# EAGLE design narvi-cpu (EAGLE 7.3.0)
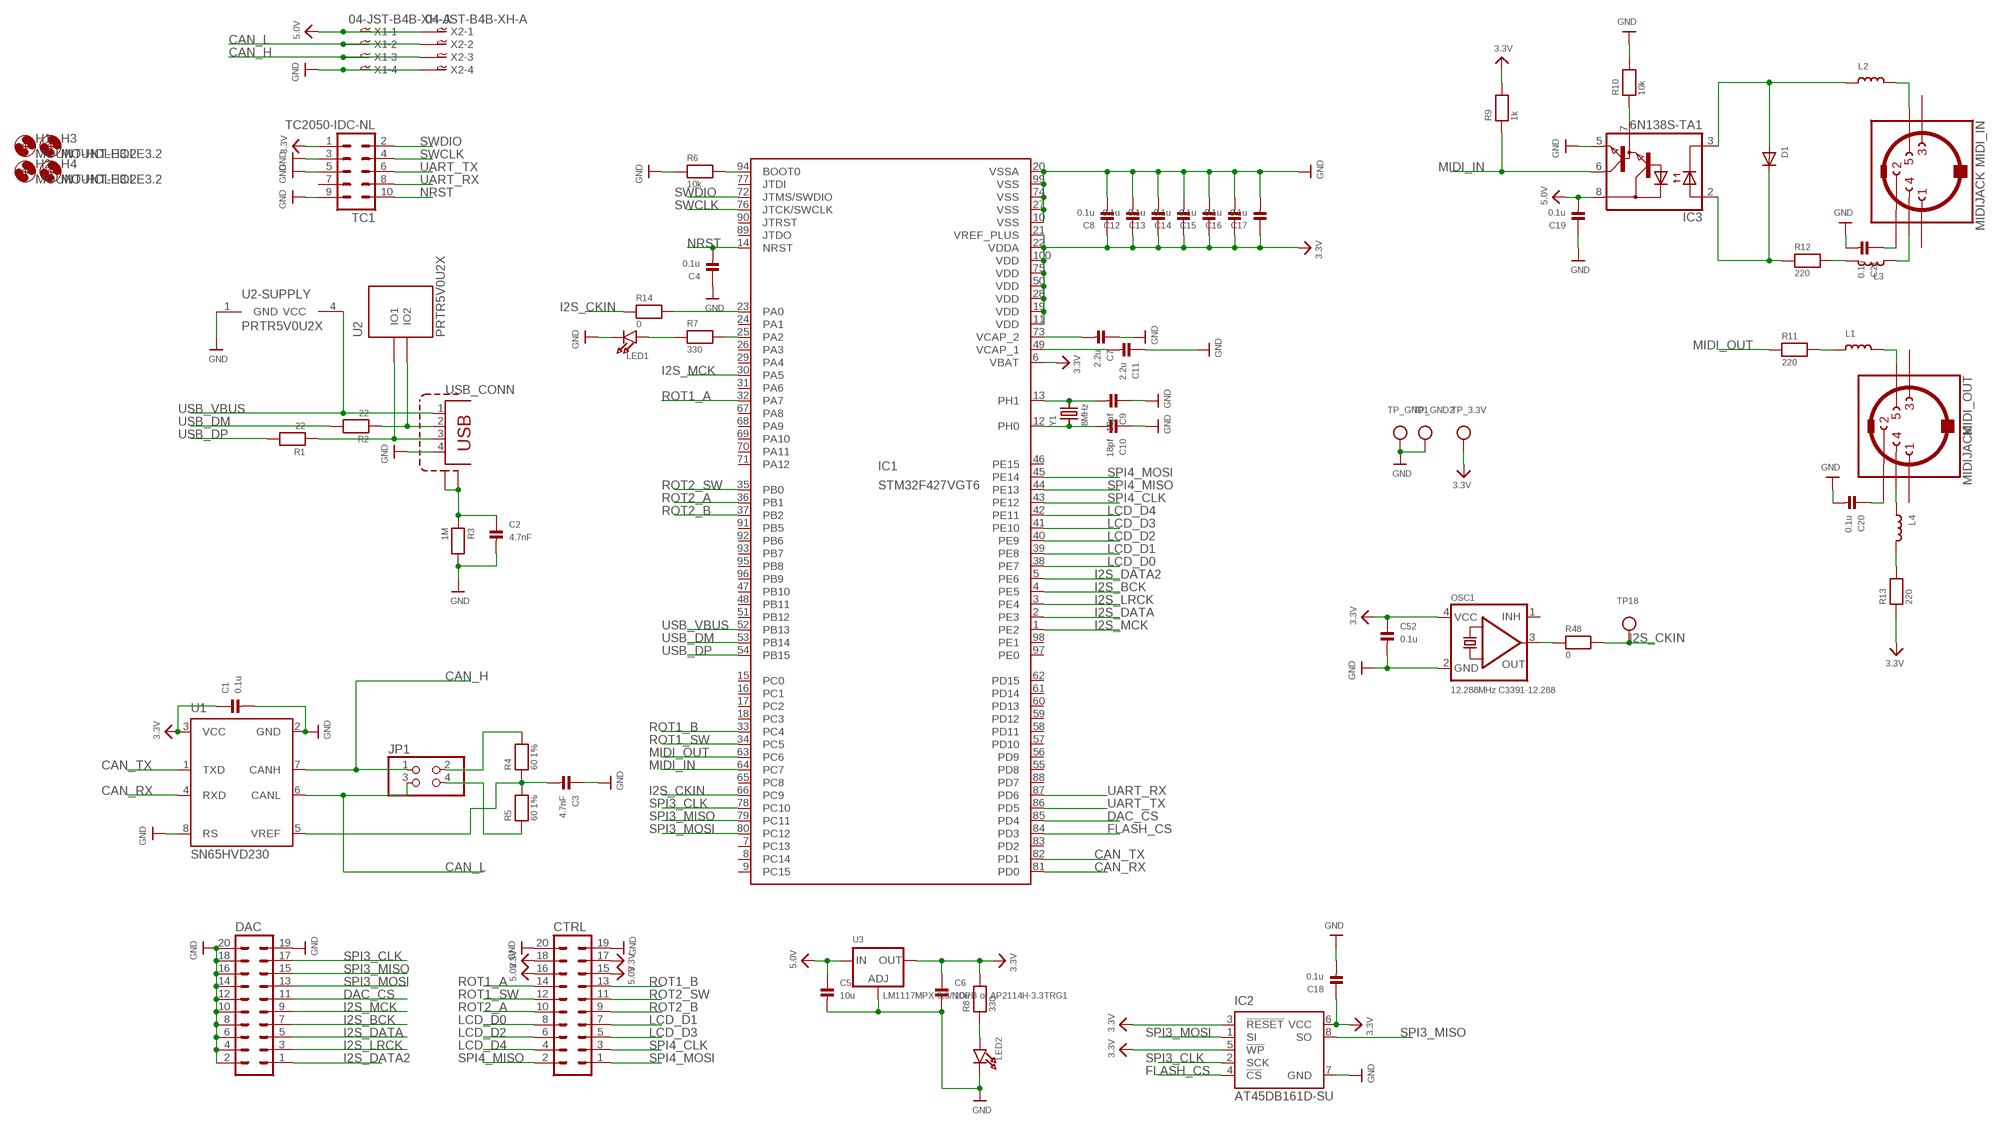
[diagram p0: schematic, sheet 1]

## Parts
C1  0.1u  CAP_CERAMIC0603  [0603]
C2  4.7nF  CAP_CERAMIC0805  [0805]
C3  4.7nF  CAP_CERAMIC0805  [0805]
C4  0.1u  CAP_CERAMIC0603  [0603]
C5  10u  CAP_CERAMIC0805  [0805]
C6  10u  CAP_CERAMIC0805  [0805]
C7  2.2u  CAP_CERAMIC0805  [0805]
C8  0.1u  CAP_CERAMIC0603  [0603]
C9  18pf  CAP_CERAMIC0805  [0805]
C10  18pf  CAP_CERAMIC0805  [0805]
C11  2.2u  CAP_CERAMIC0805  [0805]
C12  0.1u  CAP_CERAMIC0603  [0603]
C13  0.1u  CAP_CERAMIC0603  [0603]
C14  0.1u  CAP_CERAMIC0603  [0603]
C15  0.1u  CAP_CERAMIC0603  [0603]
C16  0.1u  CAP_CERAMIC0603  [0603]
C17  0.1u  CAP_CERAMIC0603  [0603]
C18  0.1u  CAP_CERAMIC0603  [0603]
C19  0.1u  CAP_CERAMIC0603  [0603]
C20  0.1u  CAP_CERAMIC0603  [0603]
C21  0.1u  CAP_CERAMIC0603  [0603]
C52  0.1u  CAP_CERAMIC0603  [0603]
CTRL  ML20  [ML20]
D1  DIODESOD-123  [SOD-123]
DAC  ML20  [ML20]
H1  MOUNT-HOLE3.2  [3,2]
H2  MOUNT-HOLE3.2  [3,2]
H3  MOUNT-HOLE3.2  [3,2]
H4  MOUNT-HOLE3.2  [3,2]
IC1  STM32F427VGT6  STM32F42X_43X_LQFP100  [TQFP100]
IC2  AT45DB161D-SU  [8S2]
IC3  6N138S-TA1  6N138SMD  [SO8-GW300]
JP1  PINHD-2X2  [2X02]
L1  INDUCTOR0805  [0805]
L2  INDUCTOR0805  [0805]
L3  INDUCTOR0805  [0805]
L4  INDUCTOR0805  [0805]
LED1  LED0805  [CHIPLED_0805]
LED2  LED0805  [CHIPLED_0805]
MIDI_IN  MIDIJACK  [CP-2350]
MIDI_OUT  MIDIJACK  [CP-2350]
OSC1  12.288MHz C3391-12.288  OSCILLATOR  [OSC_7X5MM]
R1  22  RESISTOR0805  [0805]
R2  22  RESISTOR0805  [0805]
R3  1M  RESISTOR0805  [0805]
R4  60 1%  RESISTOR0805  [0805]
R5  60 1%  RESISTOR0805  [0805]
R6  10k  RESISTOR0805  [0805]
R7  330  RESISTOR0805  [0805]
R8  330  RESISTOR0805  [0805]
R9  1k  RESISTOR0805  [0805]
R10  10k  RESISTOR0805  [0805]
R11  220  RESISTOR0805  [0805]
R12  220  RESISTOR0805  [0805]
R13  220  RESISTOR0805  [0805]
R14  0  RESISTOR0805  [0805]
R48  0  RESISTOR_0805  [_0805]
TC1  TC2050-IDC-NL  [TC2050-IDC-NL]
TP18  TESTPOINT0.1"  [1X01_ROUND]
TP_3.3V  TESTPOINT0.1"  [1X01_ROUND]
TP_GND1  TESTPOINT0.1"  [1X01_ROUND]
TP_GND2  TESTPOINT0.1"  [1X01_ROUND]
U1  SN65HVD230  [SO8]
U2  PRTR5V0U2X  [SOT-143B]
U3  LM1117MPX-3.3/NOPB or AP2114H-3.3TRG1  LM1117SOT223-REFLOW  [SOT223-R]
USB  TE-292304-1  [TE-292304-1]
X1  04-JST-B4B-XH-A  [B4B-XH]
X2  04-JST-B4B-XH-A  [B4B-XH]
Y1  8MHz  CRYSTALSMD  [HC49UP]

## Nets
3.3V: C1.1 C6.1 C8.1 C12.1 C13.1 C14.1 C15.1 C16.1 C17.1 C18.1 C52.1 CTRL.17 CTRL.18 IC1.6(VBAT) IC1.11(VDD) IC1.19(VDD) IC1.21(VREF_PLUS) IC1.22(VDDA) IC1.28(VDD) IC1.50(VDD) IC1.75(VDD) IC1.100(VDD) IC2.3(!RESET) IC2.5(!WP) IC2.6(VCC) OSC1.4(VCC) R8.2 R9.2 R13.1 TC1.1 TP_3.3V.1 U1.3(VCC) U3.2(OUT)
5.0V: C5.1 C19.2 CTRL.15 CTRL.16 IC3.8(VCC) U3.3(IN) X1.P$1 X2.P$1
CAN_H: JP1.1 U1.7(CANH) X1.P$3 X2.P$3
CAN_L: JP1.3 U1.6(CANL) X1.P$2 X2.P$2
CAN_RX: IC1.81(PD0) U1.4(RXD)
CAN_TX: IC1.82(PD1) U1.1(TXD)
DAC_CS: DAC.11 IC1.85(PD4)
FLASH_CS: IC1.84(PD3) IC2.4(!CS)
GND: C1.2 C2.2 C3.1 C4.1 C5.2 C6.2 C7.1 C8.2 C9.1 C10.1 C11.1 C12.2 C13.2 C14.2 C15.2 C16.2 C17.2 C18.2 C19.1 C20.2 C21.2 C52.2 CTRL.19 CTRL.20 DAC.2 DAC.4 DAC.6 DAC.8 DAC.10 DAC.12 DAC.14 DAC.16 DAC.18 DAC.19 DAC.20 IC1.10(VSS) IC1.20(VSSA) IC1.27(VSS) IC1.74(VSS) IC1.99(VSS) IC2.7(GND) IC3.5(GND) LED1.C LED2.C OSC1.2(GND) R3.2 R6.1 R10.2 TC1.3 TC1.5 TC1.9 TP_GND1.1 TP_GND2.1 U1.2(GND) U1.8(RS) U2.1(GND) U3.1(ADJ) USB.4 X1.P$4 X2.P$4
I2S_BCK: DAC.7 IC1.4(PE5)
I2S_CKIN: IC1.66(PC9) R14.1 R48.2 TP18.1
I2S_DATA: DAC.5 IC1.2(PE3)
I2S_DATA2: DAC.1 IC1.5(PE6)
I2S_LRCK: DAC.3 IC1.3(PE4)
I2S_MCK: DAC.9 IC1.1(PE2) IC1.30(PA5)
LCD_D0: CTRL.8 IC1.38(PE7)
LCD_D1: CTRL.7 IC1.39(PE8)
LCD_D2: CTRL.6 IC1.40(PE9)
LCD_D3: CTRL.5 IC1.41(PE10)
LCD_D4: CTRL.4 IC1.42(PE11)
MIDI_IN: IC1.64(PC7) IC3.6(VO) R9.1
MIDI_OUT: IC1.63(PC6) R11.1
N$1: IC1.94(BOOT0) R6.2
N$2: C11.2 IC1.49(VCAP_1)
N$3: C7.2 IC1.73(VCAP_2)
N$4: C9.2 IC1.13(PH1) Y1.2
N$5: C10.2 IC1.12(PH0) Y1.1
N$6: LED2.A R8.1
N$7: JP1.2 R4.2
N$8: JP1.4 R5.1
N$9: C3.2 R4.1 R5.2 U1.5(VREF)
N$10: IC1.25(PA2) R7.2
N$11: IC1.23(PA0) R14.2
N$12: LED1.A R7.1
N$14: L1.2 MIDI_OUT.5
N$15: L1.1 R11.2
N$16: L3.1 MIDI_IN.4
N$17: D1.C IC3.2(A) R12.1
N$18: R2.1 U2.3(IO2) USB.2
N$19: R1.1 U2.2(IO1) USB.3
N$20: C2.1 R3.1 USB.P$1(SHIELD:S1) USB.P$2(SHIELD:S2)
N$21: D1.A IC3.3(C) L2.1
N$22: IC3.7(VB) R10.1
N$23: C20.1 MIDI_OUT.2
N$24: C21.1 MIDI_IN.2
N$25: L2.2 MIDI_IN.5
N$26: L3.2 R12.2
N$27: L4.2 R13.2
N$28: L4.1 MIDI_OUT.4
N$32: OSC1.3(OUT) R48.1
NRST: C4.2 IC1.14(NRST) TC1.10
ROT1_A: CTRL.14 IC1.32(PA7)
ROT1_B: CTRL.13 IC1.33(PC4)
ROT1_SW: CTRL.12 IC1.34(PC5)
ROT2_A: CTRL.10 IC1.36(PB1)
ROT2_B: CTRL.9 IC1.37(PB2)
ROT2_SW: CTRL.11 IC1.35(PB0)
SPI3_CLK: DAC.17 IC1.78(PC10) IC2.2(SCK)
SPI3_MISO: DAC.15 IC1.79(PC11) IC2.8(SO)
SPI3_MOSI: DAC.13 IC1.80(PC12) IC2.1(SI)
SPI4_CLK: CTRL.3 IC1.43(PE12)
SPI4_MISO: CTRL.2 IC1.44(PE13)
SPI4_MOSI: CTRL.1 IC1.45(PE14)
SWCLK: IC1.76(JTCK/SWCLK) TC1.4
SWDIO: IC1.72(JTMS/SWDIO) TC1.2
UART_RX: IC1.87(PD6) TC1.8
UART_TX: IC1.86(PD5) TC1.6
USB_DM: IC1.53(PB14) R2.2
USB_DP: IC1.54(PB15) R1.2
USB_VBUS: IC1.52(PB13) U2.4(VCC) USB.1
Unconnected: IC1.7(PC13) IC1.8(PC14) IC1.9(PC15) IC1.15(PC0) IC1.16(PC1) IC1.17(PC2) IC1.18(PC3) IC1.24(PA1) IC1.26(PA3) IC1.29(PA4) IC1.31(PA6) IC1.46(PE15) IC1.47(PB10) IC1.48(PB11) IC1.51(PB12) IC1.55(PD8) IC1.56(PD9) IC1.57(PD10) IC1.58(PD11) IC1.59(PD12) IC1.60(PD13) IC1.61(PD14) IC1.62(PD15) IC1.65(PC8) IC1.67(PA8) IC1.68(PA9) IC1.69(PA10) IC1.70(PA11) IC1.71(PA12) IC1.77(JTDI) IC1.83(PD2) IC1.88(PD7) IC1.89(JTDO) IC1.90(JTRST) IC1.91(PB5) IC1.92(PB6) IC1.93(PB7) IC1.95(PB8) IC1.96(PB9) IC1.97(PE0) IC1.98(PE1) MIDI_IN.1 MIDI_IN.3 MIDI_OUT.1 MIDI_OUT.3 OSC1.1(INH) TC1.7

## Library data of the parts
C1 C4 C8 C12-C21 = microbuilder:CAP_CERAMIC: Ceramic Capacitors 0402 - 0402 Surface Mount Capacitors 16pF 50V 5% [Digikey: 445-4899-2-ND] 18pF 50V 5% [Digikey: 490-1281-2-ND] 22pF 50V 5% [Digikey: 490-1283-2-ND] 68pF 50V 5% [Digikey: 490-1289-2-ND] 0.1uF 10V 10% [Digikey: 490-1318-2-ND] 1.0uF 6.3V 10% [Digikey: 490-1320-2-ND] 0603 - 0603 Surface Mount Capacitors 16 pF 50V 5% [Digikey: 445-5051-2-ND] 22 pF 50V [Digikey: PCC220ACVTR-ND] 33 pF 50V 5% [Digikey: 490-1415-1-ND] 56pF 50V 5% [Digikey: 490-1421-1-ND] 220pF 50V 5% [Digikey: 445-1285-1-ND] 680 pF 50V 2200 pF 50V 5% C0G [Digikey: 445-1297-1-ND] 5600 pF 100V 5% X7R [Digikey: 478-3711-1-ND] 0.1 µF 25V 10% [Digikey: PCC2277TR-ND] 0.22 µF 16V 10% X7R [Digikey: 445-1318-1-ND] 1.0 µF 25V 10% [Digikey: 445-5146-2-ND] 0603 - RF Specific 3pF 250V +/-0.1pF RF [Digikey: 712-1347-1-ND] 18 pF 250V 5% [Digikey: 478-3505-1-ND or 712-1322-1-ND] 56 pF 250V 5% C0G RF [Digikey: 490-4867-1-ND] 68 pF 250V RF [Digikey: 490-4868-1-ND] 0805 - 0805 Surface Mount Capacitors 220 pF 250V 2% RF Ceramic Capacitor [Digikey: 712-1398-1-ND] 1000 pF 50V 2% NP0 Ceramic Capacitor [Digikey: 478-3760-1-ND] 0.1 µF 25V 10% Ceramic Capacitor [Digikey: PCC1828TR-ND] 1.0 µF 16V 10% Ceramic Capacitor[Digikey: 490-1691-2-ND] 10.0 µF 10V 10% Ceramic Capacitor[Digikey: 709-1228-1-ND] 10.0 uF 16V 10% Ceramic Capacitor [Digikey: 478-5165-2-ND] 47 uF 6.3V 20% Ceramic Capacitor [Digikey: 587-1779-1-ND or 399-5506-1-ND] 1206 - 1206 Surface Mount Capacitors 47uF 10V 20% Ceramic Capacitor [Digikey: 490-5528-1-ND or 399-5508-1-ND or 445-6010-1-ND] 100uF 6.3V -20%, +80% Y5V Ceramic Capacitor (Digikey: 490-4512-1-ND, Mouser: 81-GRM31CF50J107ZE1L); PARTNO: 0805DD104KAT2A
C2 C3 = microbuilder:CAP_CERAMIC: Ceramic Capacitors 0402 - 0402 Surface Mount Capacitors 16pF 50V 5% [Digikey: 445-4899-2-ND] 18pF 50V 5% [Digikey: 490-1281-2-ND] 22pF 50V 5% [Digikey: 490-1283-2-ND] 68pF 50V 5% [Digikey: 490-1289-2-ND] 0.1uF 10V 10% [Digikey: 490-1318-2-ND] 1.0uF 6.3V 10% [Digikey: 490-1320-2-ND] 0603 - 0603 Surface Mount Capacitors 16 pF 50V 5% [Digikey: 445-5051-2-ND] 22 pF 50V [Digikey: PCC220ACVTR-ND] 33 pF 50V 5% [Digikey: 490-1415-1-ND] 56pF 50V 5% [Digikey: 490-1421-1-ND] 220pF 50V 5% [Digikey: 445-1285-1-ND] 680 pF 50V 2200 pF 50V 5% C0G [Digikey: 445-1297-1-ND] 5600 pF 100V 5% X7R [Digikey: 478-3711-1-ND] 0.1 µF 25V 10% [Digikey: PCC2277TR-ND] 0.22 µF 16V 10% X7R [Digikey: 445-1318-1-ND] 1.0 µF 25V 10% [Digikey: 445-5146-2-ND] 0603 - RF Specific 3pF 250V +/-0.1pF RF [Digikey: 712-1347-1-ND] 18 pF 250V 5% [Digikey: 478-3505-1-ND or 712-1322-1-ND] 56 pF 250V 5% C0G RF [Digikey: 490-4867-1-ND] 68 pF 250V RF [Digikey: 490-4868-1-ND] 0805 - 0805 Surface Mount Capacitors 220 pF 250V 2% RF Ceramic Capacitor [Digikey: 712-1398-1-ND] 1000 pF 50V 2% NP0 Ceramic Capacitor [Digikey: 478-3760-1-ND] 0.1 µF 25V 10% Ceramic Capacitor [Digikey: PCC1828TR-ND] 1.0 µF 16V 10% Ceramic Capacitor[Digikey: 490-1691-2-ND] 10.0 µF 10V 10% Ceramic Capacitor[Digikey: 709-1228-1-ND] 10.0 uF 16V 10% Ceramic Capacitor [Digikey: 478-5165-2-ND] 47 uF 6.3V 20% Ceramic Capacitor [Digikey: 587-1779-1-ND or 399-5506-1-ND] 1206 - 1206 Surface Mount Capacitors 47uF 10V 20% Ceramic Capacitor [Digikey: 490-5528-1-ND or 399-5508-1-ND or 445-6010-1-ND] 100uF 6.3V -20%, +80% Y5V Ceramic Capacitor (Digikey: 490-4512-1-ND, Mouser: 81-GRM31CF50J107ZE1L); PARTNO: 885012207090
C5 C6 = microbuilder:CAP_CERAMIC: Ceramic Capacitors 0402 - 0402 Surface Mount Capacitors 16pF 50V 5% [Digikey: 445-4899-2-ND] 18pF 50V 5% [Digikey: 490-1281-2-ND] 22pF 50V 5% [Digikey: 490-1283-2-ND] 68pF 50V 5% [Digikey: 490-1289-2-ND] 0.1uF 10V 10% [Digikey: 490-1318-2-ND] 1.0uF 6.3V 10% [Digikey: 490-1320-2-ND] 0603 - 0603 Surface Mount Capacitors 16 pF 50V 5% [Digikey: 445-5051-2-ND] 22 pF 50V [Digikey: PCC220ACVTR-ND] 33 pF 50V 5% [Digikey: 490-1415-1-ND] 56pF 50V 5% [Digikey: 490-1421-1-ND] 220pF 50V 5% [Digikey: 445-1285-1-ND] 680 pF 50V 2200 pF 50V 5% C0G [Digikey: 445-1297-1-ND] 5600 pF 100V 5% X7R [Digikey: 478-3711-1-ND] 0.1 µF 25V 10% [Digikey: PCC2277TR-ND] 0.22 µF 16V 10% X7R [Digikey: 445-1318-1-ND] 1.0 µF 25V 10% [Digikey: 445-5146-2-ND] 0603 - RF Specific 3pF 250V +/-0.1pF RF [Digikey: 712-1347-1-ND] 18 pF 250V 5% [Digikey: 478-3505-1-ND or 712-1322-1-ND] 56 pF 250V 5% C0G RF [Digikey: 490-4867-1-ND] 68 pF 250V RF [Digikey: 490-4868-1-ND] 0805 - 0805 Surface Mount Capacitors 220 pF 250V 2% RF Ceramic Capacitor [Digikey: 712-1398-1-ND] 1000 pF 50V 2% NP0 Ceramic Capacitor [Digikey: 478-3760-1-ND] 0.1 µF 25V 10% Ceramic Capacitor [Digikey: PCC1828TR-ND] 1.0 µF 16V 10% Ceramic Capacitor[Digikey: 490-1691-2-ND] 10.0 µF 10V 10% Ceramic Capacitor[Digikey: 709-1228-1-ND] 10.0 uF 16V 10% Ceramic Capacitor [Digikey: 478-5165-2-ND] 47 uF 6.3V 20% Ceramic Capacitor [Digikey: 587-1779-1-ND or 399-5506-1-ND] 1206 - 1206 Surface Mount Capacitors 47uF 10V 20% Ceramic Capacitor [Digikey: 490-5528-1-ND or 399-5508-1-ND or 445-6010-1-ND] 100uF 6.3V -20%, +80% Y5V Ceramic Capacitor (Digikey: 490-4512-1-ND, Mouser: 81-GRM31CF50J107ZE1L); PARTNO: 81-GRM21BR6YA106KE3L
C7 C11 = microbuilder:CAP_CERAMIC: Ceramic Capacitors 0402 - 0402 Surface Mount Capacitors 16pF 50V 5% [Digikey: 445-4899-2-ND] 18pF 50V 5% [Digikey: 490-1281-2-ND] 22pF 50V 5% [Digikey: 490-1283-2-ND] 68pF 50V 5% [Digikey: 490-1289-2-ND] 0.1uF 10V 10% [Digikey: 490-1318-2-ND] 1.0uF 6.3V 10% [Digikey: 490-1320-2-ND] 0603 - 0603 Surface Mount Capacitors 16 pF 50V 5% [Digikey: 445-5051-2-ND] 22 pF 50V [Digikey: PCC220ACVTR-ND] 33 pF 50V 5% [Digikey: 490-1415-1-ND] 56pF 50V 5% [Digikey: 490-1421-1-ND] 220pF 50V 5% [Digikey: 445-1285-1-ND] 680 pF 50V 2200 pF 50V 5% C0G [Digikey: 445-1297-1-ND] 5600 pF 100V 5% X7R [Digikey: 478-3711-1-ND] 0.1 µF 25V 10% [Digikey: PCC2277TR-ND] 0.22 µF 16V 10% X7R [Digikey: 445-1318-1-ND] 1.0 µF 25V 10% [Digikey: 445-5146-2-ND] 0603 - RF Specific 3pF 250V +/-0.1pF RF [Digikey: 712-1347-1-ND] 18 pF 250V 5% [Digikey: 478-3505-1-ND or 712-1322-1-ND] 56 pF 250V 5% C0G RF [Digikey: 490-4867-1-ND] 68 pF 250V RF [Digikey: 490-4868-1-ND] 0805 - 0805 Surface Mount Capacitors 220 pF 250V 2% RF Ceramic Capacitor [Digikey: 712-1398-1-ND] 1000 pF 50V 2% NP0 Ceramic Capacitor [Digikey: 478-3760-1-ND] 0.1 µF 25V 10% Ceramic Capacitor [Digikey: PCC1828TR-ND] 1.0 µF 16V 10% Ceramic Capacitor[Digikey: 490-1691-2-ND] 10.0 µF 10V 10% Ceramic Capacitor[Digikey: 709-1228-1-ND] 10.0 uF 16V 10% Ceramic Capacitor [Digikey: 478-5165-2-ND] 47 uF 6.3V 20% Ceramic Capacitor [Digikey: 587-1779-1-ND or 399-5506-1-ND] 1206 - 1206 Surface Mount Capacitors 47uF 10V 20% Ceramic Capacitor [Digikey: 490-5528-1-ND or 399-5508-1-ND or 445-6010-1-ND] 100uF 6.3V -20%, +80% Y5V Ceramic Capacitor (Digikey: 490-4512-1-ND, Mouser: 81-GRM31CF50J107ZE1L); PARTNO: 581-08053D225MAT2A
C9 C10 = microbuilder:CAP_CERAMIC: Ceramic Capacitors 0402 - 0402 Surface Mount Capacitors 16pF 50V 5% [Digikey: 445-4899-2-ND] 18pF 50V 5% [Digikey: 490-1281-2-ND] 22pF 50V 5% [Digikey: 490-1283-2-ND] 68pF 50V 5% [Digikey: 490-1289-2-ND] 0.1uF 10V 10% [Digikey: 490-1318-2-ND] 1.0uF 6.3V 10% [Digikey: 490-1320-2-ND] 0603 - 0603 Surface Mount Capacitors 16 pF 50V 5% [Digikey: 445-5051-2-ND] 22 pF 50V [Digikey: PCC220ACVTR-ND] 33 pF 50V 5% [Digikey: 490-1415-1-ND] 56pF 50V 5% [Digikey: 490-1421-1-ND] 220pF 50V 5% [Digikey: 445-1285-1-ND] 680 pF 50V 2200 pF 50V 5% C0G [Digikey: 445-1297-1-ND] 5600 pF 100V 5% X7R [Digikey: 478-3711-1-ND] 0.1 µF 25V 10% [Digikey: PCC2277TR-ND] 0.22 µF 16V 10% X7R [Digikey: 445-1318-1-ND] 1.0 µF 25V 10% [Digikey: 445-5146-2-ND] 0603 - RF Specific 3pF 250V +/-0.1pF RF [Digikey: 712-1347-1-ND] 18 pF 250V 5% [Digikey: 478-3505-1-ND or 712-1322-1-ND] 56 pF 250V 5% C0G RF [Digikey: 490-4867-1-ND] 68 pF 250V RF [Digikey: 490-4868-1-ND] 0805 - 0805 Surface Mount Capacitors 220 pF 250V 2% RF Ceramic Capacitor [Digikey: 712-1398-1-ND] 1000 pF 50V 2% NP0 Ceramic Capacitor [Digikey: 478-3760-1-ND] 0.1 µF 25V 10% Ceramic Capacitor [Digikey: PCC1828TR-ND] 1.0 µF 16V 10% Ceramic Capacitor[Digikey: 490-1691-2-ND] 10.0 µF 10V 10% Ceramic Capacitor[Digikey: 709-1228-1-ND] 10.0 uF 16V 10% Ceramic Capacitor [Digikey: 478-5165-2-ND] 47 uF 6.3V 20% Ceramic Capacitor [Digikey: 587-1779-1-ND or 399-5506-1-ND] 1206 - 1206 Surface Mount Capacitors 47uF 10V 20% Ceramic Capacitor [Digikey: 490-5528-1-ND or 399-5508-1-ND or 445-6010-1-ND] 100uF 6.3V -20%, +80% Y5V Ceramic Capacitor (Digikey: 490-4512-1-ND, Mouser: 81-GRM31CF50J107ZE1L); PARTNO: C0805C180M3GACTU
C52 = microbuilder:CAP_CERAMIC: Ceramic Capacitors 0402 - 0402 Surface Mount Capacitors 16pF 50V 5% [Digikey: 445-4899-2-ND] 18pF 50V 5% [Digikey: 490-1281-2-ND] 22pF 50V 5% [Digikey: 490-1283-2-ND] 68pF 50V 5% [Digikey: 490-1289-2-ND] 0.1uF 10V 10% [Digikey: 490-1318-2-ND] 1.0uF 6.3V 10% [Digikey: 490-1320-2-ND] 0603 - 0603 Surface Mount Capacitors 16 pF 50V 5% [Digikey: 445-5051-2-ND] 22 pF 50V [Digikey: PCC220ACVTR-ND] 33 pF 50V 5% [Digikey: 490-1415-1-ND] 56pF 50V 5% [Digikey: 490-1421-1-ND] 220pF 50V 5% [Digikey: 445-1285-1-ND] 680 pF 50V 2200 pF 50V 5% C0G [Digikey: 445-1297-1-ND] 5600 pF 100V 5% X7R [Digikey: 478-3711-1-ND] 0.1 µF 25V 10% [Digikey: PCC2277TR-ND] 0.22 µF 16V 10% X7R [Digikey: 445-1318-1-ND] 1.0 µF 25V 10% [Digikey: 445-5146-2-ND] 0603 - RF Specific 3pF 250V +/-0.1pF RF [Digikey: 712-1347-1-ND] 18 pF 250V 5% [Digikey: 478-3505-1-ND or 712-1322-1-ND] 56 pF 250V 5% C0G RF [Digikey: 490-4867-1-ND] 68 pF 250V RF [Digikey: 490-4868-1-ND] 0805 - 0805 Surface Mount Capacitors 220 pF 250V 2% RF Ceramic Capacitor [Digikey: 712-1398-1-ND] 1000 pF 50V 2% NP0 Ceramic Capacitor [Digikey: 478-3760-1-ND] 0.1 µF 25V 10% Ceramic Capacitor [Digikey: PCC1828TR-ND] 1.0 µF 16V 10% Ceramic Capacitor[Digikey: 490-1691-2-ND] 10.0 µF 10V 10% Ceramic Capacitor[Digikey: 709-1228-1-ND] 10.0 uF 16V 10% Ceramic Capacitor [Digikey: 478-5165-2-ND] 47 uF 6.3V 20% Ceramic Capacitor [Digikey: 587-1779-1-ND or 399-5506-1-ND] 1206 - 1206 Surface Mount Capacitors 47uF 10V 20% Ceramic Capacitor [Digikey: 490-5528-1-ND or 399-5508-1-ND or 445-6010-1-ND] 100uF 6.3V -20%, +80% Y5V Ceramic Capacitor (Digikey: 490-4512-1-ND, Mouser: 81-GRM31CF50J107ZE1L)
CTRL DAC = con-harting-ml:ML20: HARTING; OC_FARNELL: unknown; OC_NEWARK: unknown; PARTNO: 61202021621
D1 = microbuilder:DIODE: Diode SMA Model Volts Amps Type Vf Vr Digikey # Notes SSA34-E3 40V 3A Schottky 480mV @ 3A 200uA @ 40V SSA34-E3/61TGITR-ND CDBA120-G 20V 1A Schottky 500mV @ 1A 500uA @ 20V 641-1014-6-ND REEL MBRA210 10V 2A Schottky 350mV @ 2A 700uA @ 10V MBRA210LT3 SOD-123 Model Volts Amps Type Vf Vr Order # Notes BAT54T1G 30V 200mA Schottky 800mV @ 200mA 2uA @ 25V BAT54T1GOSTR-ND B0530W 30V 500mA Schottky 430mV @ 500mA 130uA @ 30V B0530W-FDICT-ND REEL MBR120 1A 20V Schottky 340mV @ 1A MBR120VLSFT1GOSCT-ND SOD-323 Model Volts Amps Type Vf Vr Order # Notes PMEG2005EJ 20V 500mA Schottky 355mV @ 500mA 568-4110-1-ND ZLLS410 10V 570mA Schottky 380mV @ 570mA ZLLS410CT-ND 1N4148WS 75V 150mA Silicon/Simple 1V 1N4148WSFSCT-ND REEL SOD-523 Model Volts Amps Type Vf Vr Order # Notes BAT54XV2 30V 200mA Schottky 0.8V @ 100mA BAT54XV2CT-ND TB751S 30V 30mA Schottky RB751S-40TE61CT-ND SOT23-R/W (R = Solder Paste/Reflow Ovens, W = Hand-Soldering) Model Volts Amps Type Vf Vr Order # Notes BAT54FILM 40V 300mA Schottky 497-7162-1-ND; PARTNO: MBR120
H1-H4 = holes:MOUNT-HOLE: MOUNTING HOLE with drill center marker; POPULATE: 0
IC1 = keves:STM32F42X_43X_LQFP100: STM32F42x_43x_LQFP100 edit this description Auto generated by make-symbol-device-package-bsdl.ulp Rev. 44 Source: STM32F42x_43x_LQFP100.bsd; PARTNO: STM32F427VGT6
IC2 = atmel:AT45DB161D: 16-megabit 2.5V or 2.7V DataFlash Source: http://www.atmel.com/dyn/resources/prod_documents/doc3500.pdf; MF: ATMEL; MPN: AT45DB161D-SU; OC_FARNELL: 1455040; POPULATE: 0
IC3 = 6n138:6N138: MOTOROLA OPTO COUPLER; PARTNO: 6N138S
JP1 = pinhead:PINHD-2X2: PIN HEADER; MPN: 5-146254-2
L1-L4 = microbuilder:INDUCTOR: Inductors 0603: 10nH Ceramic Inductor - microwire antenna/RF (Digikey: 712-1434-2-ND) 0805: 560nH Ceramic Inductor - RF (Digikey: 553-1047-1-ND) 270nH Ceramic Inductor - Q = 40@250MHz, +-5%, 1 Ohm DC Resistance (Digikey: 535-10506-2-ND) 1007 (2518 Metric) SMT: 10µH 10% 250mOhm 820mA 1007 Inductor (Digikey: 587-2189-1-ND) 22µH 10% 500mOhm 580mA 1007 Inductor (Digikey: 587-2190-1-ND) 47µH 10% 950mOhm 420mA 1007 Inductor (Digikey: 587-2191-1-ND) 47µH 5% 100mOhm 1A 1008 Inductor (Digikey: 732-1816-1-ND) 5.0x5.0mm (Taiyo Yuden NR5040 Series) 6.8µH 20% 2.3A 64mOhm Inductor (Digikey: 587-2374-2-ND) 5.0x5.0mm (TDK VLC5045 Series) 4.7µH 20% 3.3A 34mOhm Inductor (Digikey: 445-6526-1-ND) 6.8µH 20% 2.7A 46mOhm Inductor (Digikey: 445-6527-1-ND) 6.0x6.0mm (TDK VLC6045 Series) 4.7µH 20% 3.8A 27mOhm Inductor (Digikey: 445-6538-2-ND) 6.8µH 20% 3A 41mOhm Inductor (Digikey: 445-6540-1-ND) 6.2µH 30% 2.2A 45mOhm Inductor (Digikey: SRR5028-6R2YCT-ND) - Not TDK VLC6045 but footprint should match 6.0x6.0mm (TDK SLF6045 Series) 6.8uH 30% 2A 33mOhm Inductor (Digikey: 445-4572-1-ND, Mouser: 810-SLF645T6R8N2R0PF); PARTNO: 70-ILHB0805ER601V
LED1 LED2 = microbuilder:LED: LED 0603 - 0603 Surface Mount Package 2mA: Green LED - Low Power (3.9mcd, 2ma, 1.7Vf) - Digikey: 475-2709-2-ND Orange LED - Low Power (9.8mcd, 2ma, 1.8Vf) - Digikey: 475-1194-2-ND Red LED - Low Power (5mcd, 2ma, 1.8Vf) - Digikey: 475-1195-2-ND Yellow LED - Low Power (7mcd, 2ma, 1.8Vf) - Digikey: 475-1196-2-ND 5mA: Blue LED - Low Power (17mcd, 5ma, 2.9Vf) - Digikey: LNJ937W8CRACT-ND 0805 - 0805 Surface Mount Package 2mA: Red LED (8.8mcd, 2mA, 1.8Vf, Clear) - Low Power [Digikey: 475-2510-1-ND] Green LED (5mcd, 2mA, 1.8Vf, Clear) - Low Power [Digikey: 475-2730-1-ND] Yellow LED (11.3mcd, 2mA, 1.8Vf, Clear) - Low Power [Digikey: 475-2555-1-ND] 20mA: Red LED (104mcd, 20mA, Diffused) - LS R976 [Digikey: 475-1278-6-ND] Red LED (12mcd, 20mA, 2.0Vf, Clear) - APT2012EC [Digikey: 754-1128-1-ND] Green LED (15mcd, 20mA, 2.2Vf, Clear) - APT2012GC [Digikey: 754-1131-1-ND] Orange LED (160mcd, 20mA, 2.1Vf, Clear) - APT2012SECK [Digikey: 754-1130-1-ND] 1206 - 1206 Surface Mount Package Green LED (26mcd, 20mA, Diffused) - LG N971 [Digikey: 475-1407-6-ND] Red LED (15mcd, 20mA, Diffused) - LH N974 [Digikey: 475-1416-6-ND]; PARTNO: 604-APT2012YC
MIDI_IN MIDI_OUT = keves:MIDIJACK: DIN 5 jack also known as MIDI jack A modification of conn-hirshman:MAB5SH with two options for the grounding 'teeth'
OSC1 = microbuilder:OSCILLATOR: Oscillators 3.2x2.5mm SMT 4.0MHz +/- 50ppm, 3.3V, 9mA, -40/+85°C - Digikey: 535-9752-1-ND 50MHz +/- 50ppm, 3.3V, 8mA, -10/+70°C - Digikey: 478-4792-1-ND 5x7mm SMT 4.0MHz +/-20ppm 3.3V, 20mA, -20/+70°C - Digikey: 535-9329-2-ND 50MHz +/- 25ppm 3.3V, 35mA, -40/+85°C - Digikey: 631-1197-1-ND
R1 R2 = microbuilder:RESISTOR: Resistors 0402 - 0402 Surface Mount Package 22 Ohm 1% 1/16W [Digikey: 311-22.0LRTR-ND] 33 Ohm 5% 1/16W 1.0K 5% 1/16W 1.5K 5% 1/16W 2.0K 1% 1/16W 10.0K 1% 1/16W [Digikey: 311-10.0KLRTR-ND] 10.0K 5% 1/16W [Digikey: RMCF0402JT10K0TR-ND] 12.1K 1% 1/16W [Digikey: 311-22.0LRTR-ND] 100.0K 5% 1/16W 0603 - 0603 Surface Mount Package 0 Ohm 1/10 Watt 1% Resistor 15 Ohm 1/10 Watt 1% Resistor 33 Ohm 1/10 Watt 1% Resistor 49.9 Ohm 1/10 Watt 1% Resistor 100 Ohm 1/10 Watt 1% Resistor 150 Ohm 1/10 Watt 1% Resistor 240 Ohm 1/10 Watt 1% Resistor 390 Ohm 1/10 Watt 1% Resistor 560 Ohm 1/10 Watt 1% Resistor 680 Ohm 1/10 Watt 1% Resistor 750 Ohm 1/10 Watt 1% Resistor 1.0K Ohm 1/10 Watt 1% Resistor 1.5K Ohm 1/10 Watt 1% Resistor 2.0K Ohm 1/10 Watt 1% Resistor 2.2K Ohm 1/10 Watt 1% Resistor 3.3K Ohm 1/10 Watt 1% Resistor 4.7K Ohm 1/10 Watt 1% Resistor 10.0K Ohm 1/10 Watt 1% Resistor 12.0K Ohm 1/10 Watt 1% Resistor 12.1K Ohm 1/10 Watt 1% Resistor 20.0K Ohm 1/10 Watt 1% Resistor 33.0K Ohm 1/10 Watt 1% Resistor 100.0K Ohm 1/10 Watt 1% Resistor 0805 - 0805 Surface Mount Package 0 Ohm 1/8 Watt 1% Resistor 33 Ohm 1/8 Watt 1% Resistor 100 Ohm 1/8 Watt 1% Resistor 150 Ohm 1/8 Watt 1% Resistor 200 Ohm 1/8 Watt 1% Resistor 240 Ohm 1/8 Watt 1% Resistor 330 Ohm 1/8 Watt 1% Resistor 390 Ohm 1/8 Watt 1% Resistor 470 Ohm 1/8 Watt 1% Resistor 1.0K Ohm 1/8 Watt 1% Resistor 1.5K Ohm 1/8 Watt 1% Resistor 2.0K Ohm 1/8 Watt 1% Resistor 4.7K Ohm 1/8 Watt 1% Resistor 5.1K Ohm 1/8 Watt 1% Resistor 5.6K Ohm 1/8 Watt 1% Resistor 10.0K Ohm 1/8 Watt 1% Resistor 22.0K Ohm 1/8 Watt 1% Resistor 33.0K Ohm 1/8 Watt 1% Resistor 100K Ohm 1/8 Watt 1% Resistor 1206 - 1206 Surface Mount Package 2012 - 2010 Surface Mount Package 0.11 Ohm 1/2 Watt 1% Resistor - Digikey: RHM.11UCT-ND; MPN: MF-RES-0603-22; PARTNO: ERJ-6ENF22R0V
R3 = microbuilder:RESISTOR: Resistors 0402 - 0402 Surface Mount Package 22 Ohm 1% 1/16W [Digikey: 311-22.0LRTR-ND] 33 Ohm 5% 1/16W 1.0K 5% 1/16W 1.5K 5% 1/16W 2.0K 1% 1/16W 10.0K 1% 1/16W [Digikey: 311-10.0KLRTR-ND] 10.0K 5% 1/16W [Digikey: RMCF0402JT10K0TR-ND] 12.1K 1% 1/16W [Digikey: 311-22.0LRTR-ND] 100.0K 5% 1/16W 0603 - 0603 Surface Mount Package 0 Ohm 1/10 Watt 1% Resistor 15 Ohm 1/10 Watt 1% Resistor 33 Ohm 1/10 Watt 1% Resistor 49.9 Ohm 1/10 Watt 1% Resistor 100 Ohm 1/10 Watt 1% Resistor 150 Ohm 1/10 Watt 1% Resistor 240 Ohm 1/10 Watt 1% Resistor 390 Ohm 1/10 Watt 1% Resistor 560 Ohm 1/10 Watt 1% Resistor 680 Ohm 1/10 Watt 1% Resistor 750 Ohm 1/10 Watt 1% Resistor 1.0K Ohm 1/10 Watt 1% Resistor 1.5K Ohm 1/10 Watt 1% Resistor 2.0K Ohm 1/10 Watt 1% Resistor 2.2K Ohm 1/10 Watt 1% Resistor 3.3K Ohm 1/10 Watt 1% Resistor 4.7K Ohm 1/10 Watt 1% Resistor 10.0K Ohm 1/10 Watt 1% Resistor 12.0K Ohm 1/10 Watt 1% Resistor 12.1K Ohm 1/10 Watt 1% Resistor 20.0K Ohm 1/10 Watt 1% Resistor 33.0K Ohm 1/10 Watt 1% Resistor 100.0K Ohm 1/10 Watt 1% Resistor 0805 - 0805 Surface Mount Package 0 Ohm 1/8 Watt 1% Resistor 33 Ohm 1/8 Watt 1% Resistor 100 Ohm 1/8 Watt 1% Resistor 150 Ohm 1/8 Watt 1% Resistor 200 Ohm 1/8 Watt 1% Resistor 240 Ohm 1/8 Watt 1% Resistor 330 Ohm 1/8 Watt 1% Resistor 390 Ohm 1/8 Watt 1% Resistor 470 Ohm 1/8 Watt 1% Resistor 1.0K Ohm 1/8 Watt 1% Resistor 1.5K Ohm 1/8 Watt 1% Resistor 2.0K Ohm 1/8 Watt 1% Resistor 4.7K Ohm 1/8 Watt 1% Resistor 5.1K Ohm 1/8 Watt 1% Resistor 5.6K Ohm 1/8 Watt 1% Resistor 10.0K Ohm 1/8 Watt 1% Resistor 22.0K Ohm 1/8 Watt 1% Resistor 33.0K Ohm 1/8 Watt 1% Resistor 100K Ohm 1/8 Watt 1% Resistor 1206 - 1206 Surface Mount Package 2012 - 2010 Surface Mount Package 0.11 Ohm 1/2 Watt 1% Resistor - Digikey: RHM.11UCT-ND; PARTNO: AS08J1004ET
R4 R5 = microbuilder:RESISTOR: Resistors 0402 - 0402 Surface Mount Package 22 Ohm 1% 1/16W [Digikey: 311-22.0LRTR-ND] 33 Ohm 5% 1/16W 1.0K 5% 1/16W 1.5K 5% 1/16W 2.0K 1% 1/16W 10.0K 1% 1/16W [Digikey: 311-10.0KLRTR-ND] 10.0K 5% 1/16W [Digikey: RMCF0402JT10K0TR-ND] 12.1K 1% 1/16W [Digikey: 311-22.0LRTR-ND] 100.0K 5% 1/16W 0603 - 0603 Surface Mount Package 0 Ohm 1/10 Watt 1% Resistor 15 Ohm 1/10 Watt 1% Resistor 33 Ohm 1/10 Watt 1% Resistor 49.9 Ohm 1/10 Watt 1% Resistor 100 Ohm 1/10 Watt 1% Resistor 150 Ohm 1/10 Watt 1% Resistor 240 Ohm 1/10 Watt 1% Resistor 390 Ohm 1/10 Watt 1% Resistor 560 Ohm 1/10 Watt 1% Resistor 680 Ohm 1/10 Watt 1% Resistor 750 Ohm 1/10 Watt 1% Resistor 1.0K Ohm 1/10 Watt 1% Resistor 1.5K Ohm 1/10 Watt 1% Resistor 2.0K Ohm 1/10 Watt 1% Resistor 2.2K Ohm 1/10 Watt 1% Resistor 3.3K Ohm 1/10 Watt 1% Resistor 4.7K Ohm 1/10 Watt 1% Resistor 10.0K Ohm 1/10 Watt 1% Resistor 12.0K Ohm 1/10 Watt 1% Resistor 12.1K Ohm 1/10 Watt 1% Resistor 20.0K Ohm 1/10 Watt 1% Resistor 33.0K Ohm 1/10 Watt 1% Resistor 100.0K Ohm 1/10 Watt 1% Resistor 0805 - 0805 Surface Mount Package 0 Ohm 1/8 Watt 1% Resistor 33 Ohm 1/8 Watt 1% Resistor 100 Ohm 1/8 Watt 1% Resistor 150 Ohm 1/8 Watt 1% Resistor 200 Ohm 1/8 Watt 1% Resistor 240 Ohm 1/8 Watt 1% Resistor 330 Ohm 1/8 Watt 1% Resistor 390 Ohm 1/8 Watt 1% Resistor 470 Ohm 1/8 Watt 1% Resistor 1.0K Ohm 1/8 Watt 1% Resistor 1.5K Ohm 1/8 Watt 1% Resistor 2.0K Ohm 1/8 Watt 1% Resistor 4.7K Ohm 1/8 Watt 1% Resistor 5.1K Ohm 1/8 Watt 1% Resistor 5.6K Ohm 1/8 Watt 1% Resistor 10.0K Ohm 1/8 Watt 1% Resistor 22.0K Ohm 1/8 Watt 1% Resistor 33.0K Ohm 1/8 Watt 1% Resistor 100K Ohm 1/8 Watt 1% Resistor 1206 - 1206 Surface Mount Package 2012 - 2010 Surface Mount Package 0.11 Ohm 1/2 Watt 1% Resistor - Digikey: RHM.11UCT-ND; MPN: MF-RES-0603-60.4; PARTNO: ERJ-6ENF60R4V
R6 R10 = microbuilder:RESISTOR: Resistors 0402 - 0402 Surface Mount Package 22 Ohm 1% 1/16W [Digikey: 311-22.0LRTR-ND] 33 Ohm 5% 1/16W 1.0K 5% 1/16W 1.5K 5% 1/16W 2.0K 1% 1/16W 10.0K 1% 1/16W [Digikey: 311-10.0KLRTR-ND] 10.0K 5% 1/16W [Digikey: RMCF0402JT10K0TR-ND] 12.1K 1% 1/16W [Digikey: 311-22.0LRTR-ND] 100.0K 5% 1/16W 0603 - 0603 Surface Mount Package 0 Ohm 1/10 Watt 1% Resistor 15 Ohm 1/10 Watt 1% Resistor 33 Ohm 1/10 Watt 1% Resistor 49.9 Ohm 1/10 Watt 1% Resistor 100 Ohm 1/10 Watt 1% Resistor 150 Ohm 1/10 Watt 1% Resistor 240 Ohm 1/10 Watt 1% Resistor 390 Ohm 1/10 Watt 1% Resistor 560 Ohm 1/10 Watt 1% Resistor 680 Ohm 1/10 Watt 1% Resistor 750 Ohm 1/10 Watt 1% Resistor 1.0K Ohm 1/10 Watt 1% Resistor 1.5K Ohm 1/10 Watt 1% Resistor 2.0K Ohm 1/10 Watt 1% Resistor 2.2K Ohm 1/10 Watt 1% Resistor 3.3K Ohm 1/10 Watt 1% Resistor 4.7K Ohm 1/10 Watt 1% Resistor 10.0K Ohm 1/10 Watt 1% Resistor 12.0K Ohm 1/10 Watt 1% Resistor 12.1K Ohm 1/10 Watt 1% Resistor 20.0K Ohm 1/10 Watt 1% Resistor 33.0K Ohm 1/10 Watt 1% Resistor 100.0K Ohm 1/10 Watt 1% Resistor 0805 - 0805 Surface Mount Package 0 Ohm 1/8 Watt 1% Resistor 33 Ohm 1/8 Watt 1% Resistor 100 Ohm 1/8 Watt 1% Resistor 150 Ohm 1/8 Watt 1% Resistor 200 Ohm 1/8 Watt 1% Resistor 240 Ohm 1/8 Watt 1% Resistor 330 Ohm 1/8 Watt 1% Resistor 390 Ohm 1/8 Watt 1% Resistor 470 Ohm 1/8 Watt 1% Resistor 1.0K Ohm 1/8 Watt 1% Resistor 1.5K Ohm 1/8 Watt 1% Resistor 2.0K Ohm 1/8 Watt 1% Resistor 4.7K Ohm 1/8 Watt 1% Resistor 5.1K Ohm 1/8 Watt 1% Resistor 5.6K Ohm 1/8 Watt 1% Resistor 10.0K Ohm 1/8 Watt 1% Resistor 22.0K Ohm 1/8 Watt 1% Resistor 33.0K Ohm 1/8 Watt 1% Resistor 100K Ohm 1/8 Watt 1% Resistor 1206 - 1206 Surface Mount Package 2012 - 2010 Surface Mount Package 0.11 Ohm 1/2 Watt 1% Resistor - Digikey: RHM.11UCT-ND; PARTNO: RC0805FR-0710KL
R7 R8 R14 = microbuilder:RESISTOR: Resistors 0402 - 0402 Surface Mount Package 22 Ohm 1% 1/16W [Digikey: 311-22.0LRTR-ND] 33 Ohm 5% 1/16W 1.0K 5% 1/16W 1.5K 5% 1/16W 2.0K 1% 1/16W 10.0K 1% 1/16W [Digikey: 311-10.0KLRTR-ND] 10.0K 5% 1/16W [Digikey: RMCF0402JT10K0TR-ND] 12.1K 1% 1/16W [Digikey: 311-22.0LRTR-ND] 100.0K 5% 1/16W 0603 - 0603 Surface Mount Package 0 Ohm 1/10 Watt 1% Resistor 15 Ohm 1/10 Watt 1% Resistor 33 Ohm 1/10 Watt 1% Resistor 49.9 Ohm 1/10 Watt 1% Resistor 100 Ohm 1/10 Watt 1% Resistor 150 Ohm 1/10 Watt 1% Resistor 240 Ohm 1/10 Watt 1% Resistor 390 Ohm 1/10 Watt 1% Resistor 560 Ohm 1/10 Watt 1% Resistor 680 Ohm 1/10 Watt 1% Resistor 750 Ohm 1/10 Watt 1% Resistor 1.0K Ohm 1/10 Watt 1% Resistor 1.5K Ohm 1/10 Watt 1% Resistor 2.0K Ohm 1/10 Watt 1% Resistor 2.2K Ohm 1/10 Watt 1% Resistor 3.3K Ohm 1/10 Watt 1% Resistor 4.7K Ohm 1/10 Watt 1% Resistor 10.0K Ohm 1/10 Watt 1% Resistor 12.0K Ohm 1/10 Watt 1% Resistor 12.1K Ohm 1/10 Watt 1% Resistor 20.0K Ohm 1/10 Watt 1% Resistor 33.0K Ohm 1/10 Watt 1% Resistor 100.0K Ohm 1/10 Watt 1% Resistor 0805 - 0805 Surface Mount Package 0 Ohm 1/8 Watt 1% Resistor 33 Ohm 1/8 Watt 1% Resistor 100 Ohm 1/8 Watt 1% Resistor 150 Ohm 1/8 Watt 1% Resistor 200 Ohm 1/8 Watt 1% Resistor 240 Ohm 1/8 Watt 1% Resistor 330 Ohm 1/8 Watt 1% Resistor 390 Ohm 1/8 Watt 1% Resistor 470 Ohm 1/8 Watt 1% Resistor 1.0K Ohm 1/8 Watt 1% Resistor 1.5K Ohm 1/8 Watt 1% Resistor 2.0K Ohm 1/8 Watt 1% Resistor 4.7K Ohm 1/8 Watt 1% Resistor 5.1K Ohm 1/8 Watt 1% Resistor 5.6K Ohm 1/8 Watt 1% Resistor 10.0K Ohm 1/8 Watt 1% Resistor 22.0K Ohm 1/8 Watt 1% Resistor 33.0K Ohm 1/8 Watt 1% Resistor 100K Ohm 1/8 Watt 1% Resistor 1206 - 1206 Surface Mount Package 2012 - 2010 Surface Mount Package 0.11 Ohm 1/2 Watt 1% Resistor - Digikey: RHM.11UCT-ND; MPN: MF-RES-0603-330; PARTNO: CPF0805B330RE1
R9 = microbuilder:RESISTOR: Resistors 0402 - 0402 Surface Mount Package 22 Ohm 1% 1/16W [Digikey: 311-22.0LRTR-ND] 33 Ohm 5% 1/16W 1.0K 5% 1/16W 1.5K 5% 1/16W 2.0K 1% 1/16W 10.0K 1% 1/16W [Digikey: 311-10.0KLRTR-ND] 10.0K 5% 1/16W [Digikey: RMCF0402JT10K0TR-ND] 12.1K 1% 1/16W [Digikey: 311-22.0LRTR-ND] 100.0K 5% 1/16W 0603 - 0603 Surface Mount Package 0 Ohm 1/10 Watt 1% Resistor 15 Ohm 1/10 Watt 1% Resistor 33 Ohm 1/10 Watt 1% Resistor 49.9 Ohm 1/10 Watt 1% Resistor 100 Ohm 1/10 Watt 1% Resistor 150 Ohm 1/10 Watt 1% Resistor 240 Ohm 1/10 Watt 1% Resistor 390 Ohm 1/10 Watt 1% Resistor 560 Ohm 1/10 Watt 1% Resistor 680 Ohm 1/10 Watt 1% Resistor 750 Ohm 1/10 Watt 1% Resistor 1.0K Ohm 1/10 Watt 1% Resistor 1.5K Ohm 1/10 Watt 1% Resistor 2.0K Ohm 1/10 Watt 1% Resistor 2.2K Ohm 1/10 Watt 1% Resistor 3.3K Ohm 1/10 Watt 1% Resistor 4.7K Ohm 1/10 Watt 1% Resistor 10.0K Ohm 1/10 Watt 1% Resistor 12.0K Ohm 1/10 Watt 1% Resistor 12.1K Ohm 1/10 Watt 1% Resistor 20.0K Ohm 1/10 Watt 1% Resistor 33.0K Ohm 1/10 Watt 1% Resistor 100.0K Ohm 1/10 Watt 1% Resistor 0805 - 0805 Surface Mount Package 0 Ohm 1/8 Watt 1% Resistor 33 Ohm 1/8 Watt 1% Resistor 100 Ohm 1/8 Watt 1% Resistor 150 Ohm 1/8 Watt 1% Resistor 200 Ohm 1/8 Watt 1% Resistor 240 Ohm 1/8 Watt 1% Resistor 330 Ohm 1/8 Watt 1% Resistor 390 Ohm 1/8 Watt 1% Resistor 470 Ohm 1/8 Watt 1% Resistor 1.0K Ohm 1/8 Watt 1% Resistor 1.5K Ohm 1/8 Watt 1% Resistor 2.0K Ohm 1/8 Watt 1% Resistor 4.7K Ohm 1/8 Watt 1% Resistor 5.1K Ohm 1/8 Watt 1% Resistor 5.6K Ohm 1/8 Watt 1% Resistor 10.0K Ohm 1/8 Watt 1% Resistor 22.0K Ohm 1/8 Watt 1% Resistor 33.0K Ohm 1/8 Watt 1% Resistor 100K Ohm 1/8 Watt 1% Resistor 1206 - 1206 Surface Mount Package 2012 - 2010 Surface Mount Package 0.11 Ohm 1/2 Watt 1% Resistor - Digikey: RHM.11UCT-ND; PARTNO: AS08J1001ET
R11-R13 = microbuilder:RESISTOR: Resistors 0402 - 0402 Surface Mount Package 22 Ohm 1% 1/16W [Digikey: 311-22.0LRTR-ND] 33 Ohm 5% 1/16W 1.0K 5% 1/16W 1.5K 5% 1/16W 2.0K 1% 1/16W 10.0K 1% 1/16W [Digikey: 311-10.0KLRTR-ND] 10.0K 5% 1/16W [Digikey: RMCF0402JT10K0TR-ND] 12.1K 1% 1/16W [Digikey: 311-22.0LRTR-ND] 100.0K 5% 1/16W 0603 - 0603 Surface Mount Package 0 Ohm 1/10 Watt 1% Resistor 15 Ohm 1/10 Watt 1% Resistor 33 Ohm 1/10 Watt 1% Resistor 49.9 Ohm 1/10 Watt 1% Resistor 100 Ohm 1/10 Watt 1% Resistor 150 Ohm 1/10 Watt 1% Resistor 240 Ohm 1/10 Watt 1% Resistor 390 Ohm 1/10 Watt 1% Resistor 560 Ohm 1/10 Watt 1% Resistor 680 Ohm 1/10 Watt 1% Resistor 750 Ohm 1/10 Watt 1% Resistor 1.0K Ohm 1/10 Watt 1% Resistor 1.5K Ohm 1/10 Watt 1% Resistor 2.0K Ohm 1/10 Watt 1% Resistor 2.2K Ohm 1/10 Watt 1% Resistor 3.3K Ohm 1/10 Watt 1% Resistor 4.7K Ohm 1/10 Watt 1% Resistor 10.0K Ohm 1/10 Watt 1% Resistor 12.0K Ohm 1/10 Watt 1% Resistor 12.1K Ohm 1/10 Watt 1% Resistor 20.0K Ohm 1/10 Watt 1% Resistor 33.0K Ohm 1/10 Watt 1% Resistor 100.0K Ohm 1/10 Watt 1% Resistor 0805 - 0805 Surface Mount Package 0 Ohm 1/8 Watt 1% Resistor 33 Ohm 1/8 Watt 1% Resistor 100 Ohm 1/8 Watt 1% Resistor 150 Ohm 1/8 Watt 1% Resistor 200 Ohm 1/8 Watt 1% Resistor 240 Ohm 1/8 Watt 1% Resistor 330 Ohm 1/8 Watt 1% Resistor 390 Ohm 1/8 Watt 1% Resistor 470 Ohm 1/8 Watt 1% Resistor 1.0K Ohm 1/8 Watt 1% Resistor 1.5K Ohm 1/8 Watt 1% Resistor 2.0K Ohm 1/8 Watt 1% Resistor 4.7K Ohm 1/8 Watt 1% Resistor 5.1K Ohm 1/8 Watt 1% Resistor 5.6K Ohm 1/8 Watt 1% Resistor 10.0K Ohm 1/8 Watt 1% Resistor 22.0K Ohm 1/8 Watt 1% Resistor 33.0K Ohm 1/8 Watt 1% Resistor 100K Ohm 1/8 Watt 1% Resistor 1206 - 1206 Surface Mount Package 2012 - 2010 Surface Mount Package 0.11 Ohm 1/2 Watt 1% Resistor - Digikey: RHM.11UCT-ND; PARTNO: ERJ-6GEYJ221V
R48 = microbuilder:RESISTOR: Resistors 0402 - 0402 Surface Mount Package 22 Ohm 1% 1/16W [Digikey: 311-22.0LRTR-ND] 33 Ohm 5% 1/16W 1.0K 5% 1/16W 1.5K 5% 1/16W 2.0K 1% 1/16W 10.0K 1% 1/16W [Digikey: 311-10.0KLRTR-ND] 10.0K 5% 1/16W [Digikey: RMCF0402JT10K0TR-ND] 12.1K 1% 1/16W [Digikey: 311-22.0LRTR-ND] 100.0K 5% 1/16W 0603 - 0603 Surface Mount Package 0 Ohm 1/10 Watt 1% Resistor 15 Ohm 1/10 Watt 1% Resistor 33 Ohm 1/10 Watt 1% Resistor 49.9 Ohm 1/10 Watt 1% Resistor 100 Ohm 1/10 Watt 1% Resistor 150 Ohm 1/10 Watt 1% Resistor 240 Ohm 1/10 Watt 1% Resistor 390 Ohm 1/10 Watt 1% Resistor 560 Ohm 1/10 Watt 1% Resistor 680 Ohm 1/10 Watt 1% Resistor 750 Ohm 1/10 Watt 1% Resistor 1.0K Ohm 1/10 Watt 1% Resistor 1.5K Ohm 1/10 Watt 1% Resistor 2.0K Ohm 1/10 Watt 1% Resistor 2.2K Ohm 1/10 Watt 1% Resistor 3.3K Ohm 1/10 Watt 1% Resistor 4.7K Ohm 1/10 Watt 1% Resistor 10.0K Ohm 1/10 Watt 1% Resistor 12.0K Ohm 1/10 Watt 1% Resistor 12.1K Ohm 1/10 Watt 1% Resistor 20.0K Ohm 1/10 Watt 1% Resistor 33.0K Ohm 1/10 Watt 1% Resistor 100.0K Ohm 1/10 Watt 1% Resistor 0805 - 0805 Surface Mount Package 0 Ohm 1/8 Watt 1% Resistor 33 Ohm 1/8 Watt 1% Resistor 100 Ohm 1/8 Watt 1% Resistor 150 Ohm 1/8 Watt 1% Resistor 200 Ohm 1/8 Watt 1% Resistor 240 Ohm 1/8 Watt 1% Resistor 330 Ohm 1/8 Watt 1% Resistor 390 Ohm 1/8 Watt 1% Resistor 470 Ohm 1/8 Watt 1% Resistor 1.0K Ohm 1/8 Watt 1% Resistor 1.5K Ohm 1/8 Watt 1% Resistor 2.0K Ohm 1/8 Watt 1% Resistor 4.7K Ohm 1/8 Watt 1% Resistor 5.1K Ohm 1/8 Watt 1% Resistor 5.6K Ohm 1/8 Watt 1% Resistor 10.0K Ohm 1/8 Watt 1% Resistor 22.0K Ohm 1/8 Watt 1% Resistor 33.0K Ohm 1/8 Watt 1% Resistor 100K Ohm 1/8 Watt 1% Resistor 1206 - 1206 Surface Mount Package 2012 - 2010 Surface Mount Package 0.11 Ohm 1/2 Watt 1% Resistor - Digikey: RHM.11UCT-ND
TC1 = TagConnect:TC2050-IDC: Tag-Connect In Circuit Programming & Debug Cable 10 Pin http://www.tag-connect.com; POPULATE: 0
TP18 TP_3.3V TP_GND1 TP_GND2 = microbuilder:TESTPOINT: Test Point Various test points for characterisation and PCB testing TESTPOINT_SMT - Compact Surface Mount Test Point [Digikey: 5016KTR-ND]; BOM: EXCLUDE
U1 = omc:SN65HVD230: SN65HVD230 - 3.3V CAN Transceiver - 3.3V operation - ISO 11898 compliant - up to 1Mbps - up to 120 nodes - listen only mode - slope control; MPN: SN65HVD230DR
U2 = Volks73-NXPSemiconductors:PRTR5V0U2X?: I2C-Bus EDS Protection Ulta low capacitance double rail-to-rail ESD protection diode Documentation Datasheet <http://www.nxp.com/documents/data_sheet/PRTR5V0U2X.pdf> General Description Ultra low capacitance rail-to-rail ElectroStatic Discharge (ESD) protection diode in a small SOT143B Surface-Mounted Device (SMD) plastic package designed to protect two Hi-Speed data lines or high-frequency signal lines from the damage caused by ESD and other transients. PRTR5V0U2X incorporates two pairs of ultra low capacitance rail-to-rail diodes as well as an additional ESD protection diode to ensure signal line protection even if no supply voltage is available. Features ESD protection of two Hi-Speed data lines or high-frequency signal lines Ultra low input/output to ground capacitance: C(I/O-GND) = 1 pF ESD protection up to 8kV IEC 61000-4-2, level 4 (ESD) Very low clamping voltage due to an integrated additional ESD protection diode Very low reverse current Small SMD plastic package Applications USB 2.0 ports Digital Video Interface (DVI)/High Definition Multimedia Interface (HDMI) interfaces Mobile and cordless phones Personal Digital Assistants (PDA) Digital Cameras Wide Area Network (WAN) / Local Area Network (LAN) systems PCs, notebooks, printers, and other PC peripherals; APPLICATIONS: General Purpose; BIDIRECTIONAL_CHANNELS: 2; CAPACITANCE: 1pF @ 1MHz; CURRENT_PEAK_PULSE: -; DESCRIPTION: TVS DIODE 5.5VWM SOT143B; DOCUMENTATION_LINK: <a href="http://www.nxp.com/documents/data_sheet/PRTR5V0U2X.pdf">Datasheet</a>; DOCUMENTATION_URL: http://www.nxp.com/documents/data_sheet/PRTR5V0U2X.pdf; MANUFACTURER: NXP Semiconductors; MOUNTING_TYPE: Surface Mount; MPN: PRTR5V0U2X,215; OPERATING_TEMPERATURE: -40C ~ 85C; PART_NUMBER: PRTR5V0U2X,215; POWER-PEAK_PULSE: -; POWER_LINE_PROTECTION: Yes; SUPPLIER_ITEM_LINK: <a href="http://www.digikey.com/product-detail/en/PRTR5V0U2X,215/568-4140-1-ND/1589981">Details</a>; SUPPLIER_ITEM_NUMBER: 568-4140-1-ND; SUPPLIER_ITEM_URL: http://www.digikey.com/product-detail/en/PRTR5V0U2X,215/568-4140-1-ND/1589981; SUPPLIER_LINK: <a href="http://www.digikey.com">Home Page</a>; SUPPLIER_NAME: Digi-Key; SUPPLIER_URL: http://www.digikey.com; TYPE: Steering (Rail to Rail); UNIDIRECTIONAL_CHANNELS: -; VOLTAGE_BREAKDOWN: 6V; VOLTAGE_CLAMPING: -; VOLTAGE_REVERSE: 5.5V
U3 = microbuilder:LM1117: LM1117 Voltage Regulator LM1117 Adjustable Voltage regulator [Digikey: LM1117IMP-ADJDKR-ND] LM1117 3.3V Voltage regulator [AP1117E33GDIDKR-ND] LM1117 5.0V Voltage regulator [AP1117E50GDIDKR-ND] SOT223-REFLOW - SOT223 package for solder paste/reflow ovens SOT223-WAVE - SOT223 package for hand-soldering (larger pads) Note: For the fixed-voltage regulators, simply set the ADJ pin to GND.; MPN: LM1117MPX-3.3/NOPB
USB = keves:TE-292304-1: USB A Female connector; MPN: 292304-1; POPULATE: 0
X1 X2 = bt_con-jst-xh:04-JST: JST CONNECTOR; MPN: B4B-XH-A(LF)(SN)
Y1 = microbuilder:CRYSTAL: Crystals HC49UP - Surface Mount Crystal 4.0MHz 18pF +/-30ppm Surface Mount Crystal [Digikey: 535-9857-1-ND] 12.0 MHz Surface Mount Crystal [Digikey: 535-9869-6-ND] 25.0 MHz Surface Mount Crystal [Digikey: 535-9078-1-ND] 2.5 x 2.0mm - MEMs SMT Crystal 16.0 MHz 10pF 20ppm 2.5 x 2.0mm Crystal [Digikey -40-85°C: 535-10923-1-ND] 3.2 x 2.5mm - MEMs SMT Crystal 12.0 MHz 8pF 15ppm 3.2 x 2.5mm Crystal [Digikey: -10-70°C: 644-1047-1-ND -40-125°C: 644-1128-1-ND] 16.0 MHz 8pF 15ppm 3.2 x 2.5mm Crystal [Digikey: -10-70°C: 644-1049-1-ND -40-125°C: 644-1129-2-ND] 16.0 MHz 10pF 10ppm 3.2 x 2.5mm Crystal [Digikey: 644-1100-1-ND] 27.12 MHz 18pF 30ppm 3.2 x 2.5mm Crystal [Digikey: 887-1424-1-ND] 27.12MHz 10pF 10ppm 3.2 x 2.5mm Crystal [Digikey: 887-1329-1-ND] 4.9 x 1.8mm - MEMs SMT Crystal 32.768 KHz 12.5pF 20ppm 4.9 x 1.8mm Crystal [Digikey: SE2415CT-ND] 8.0 x 3.8mm - Surface Mount Crystal 32.768kHz 12.5pF 20ppm -40°C-85°C [Digikey: 535-9166-2-ND] Cylinder 32.768KHz Cylinder Crystal (2x6mm body) [Ex. Digikey: 300-8341-2-ND]; PARTNO: ABLS2-8.000MHz-B1U-T

## Board
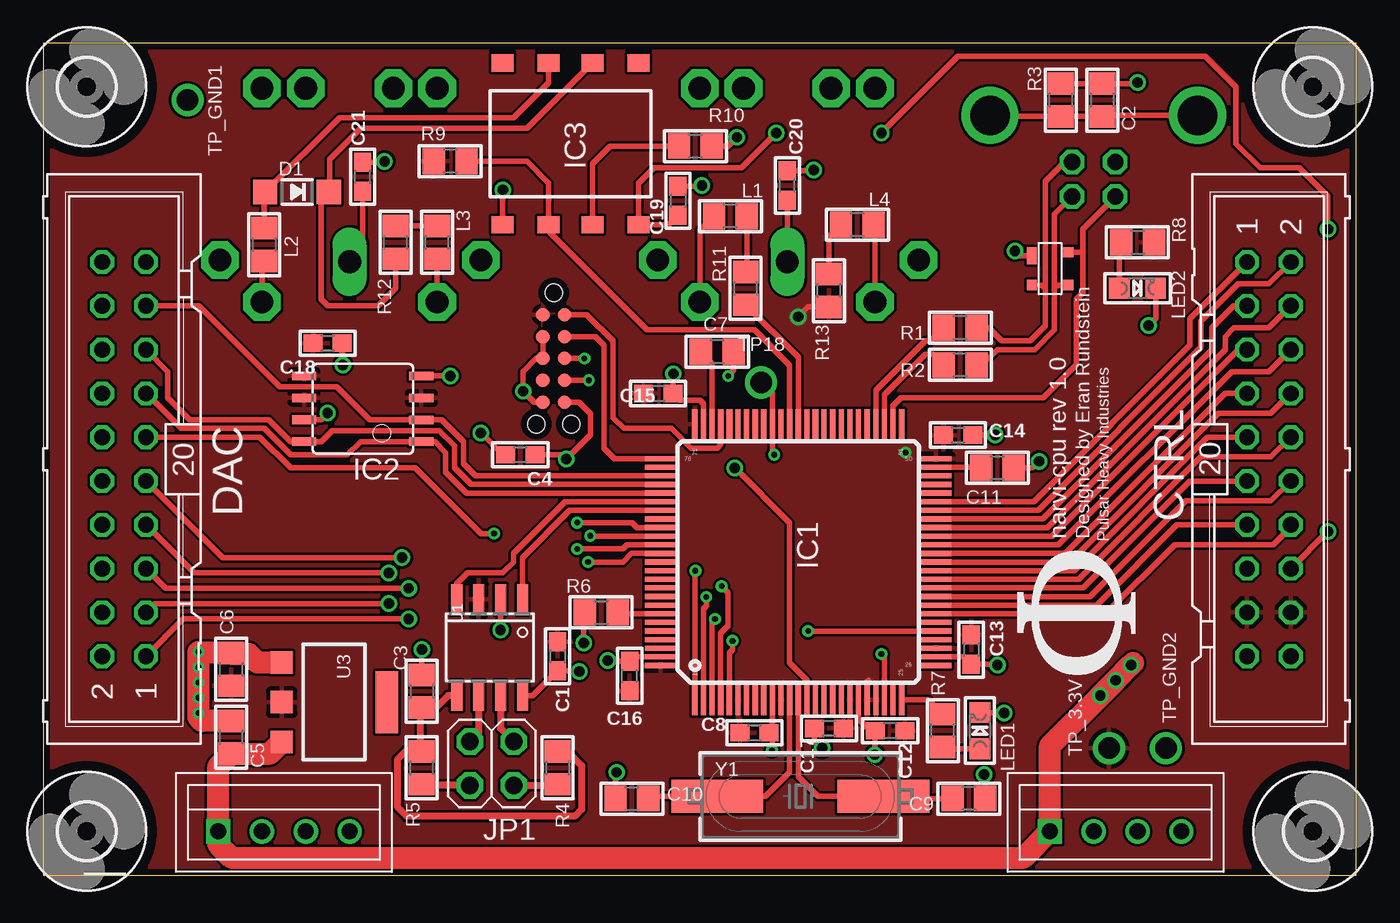
[diagram p1: board, top side]
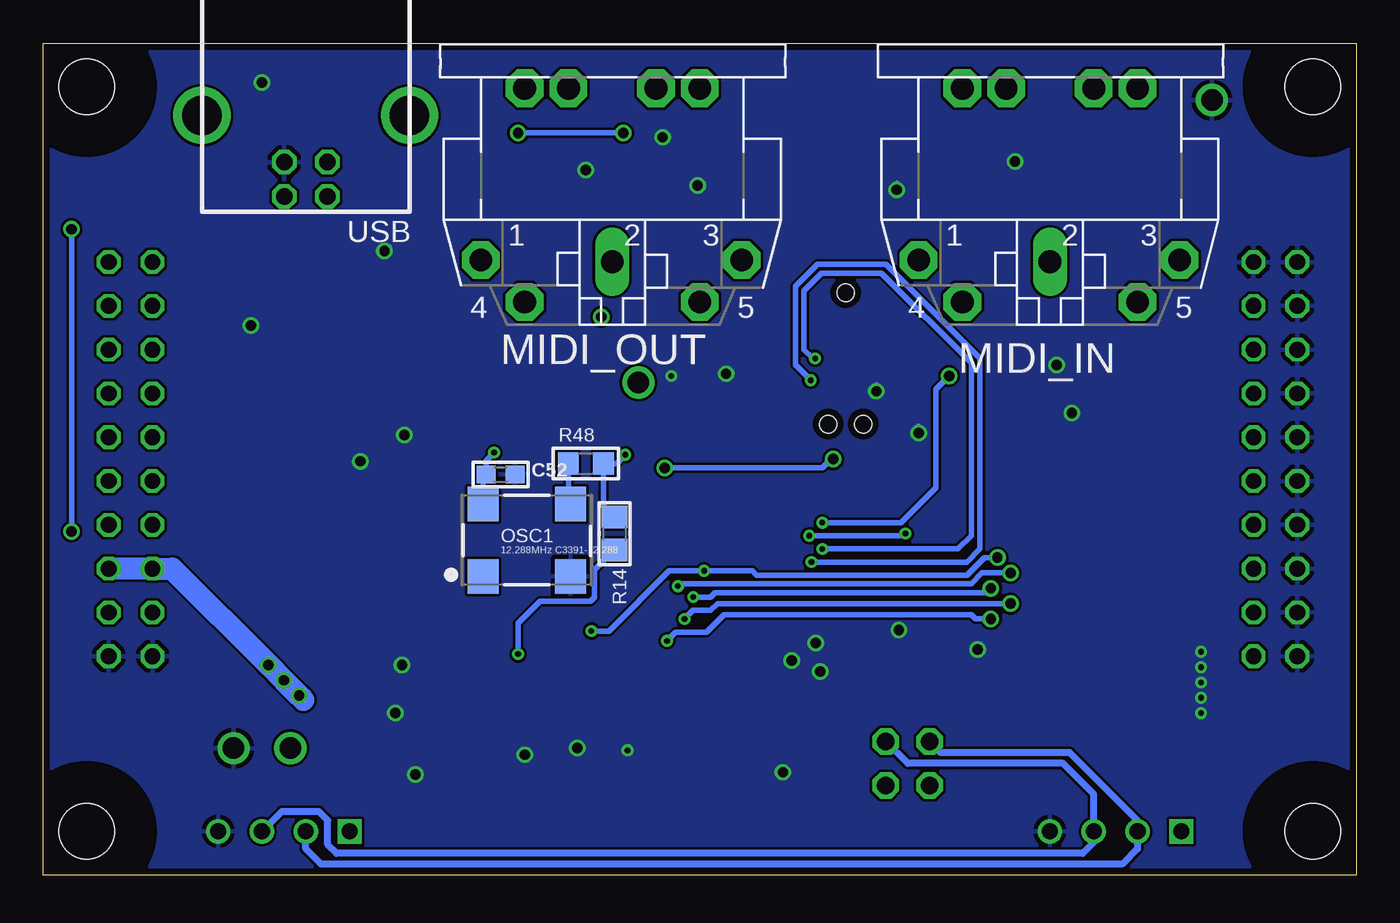
[diagram p2: board, bottom side, seen from below]

Size 76.2 x 48.26 mm. Coordinates in mm from the lower left corner, seen from the top.
Outline: 0,0 76.2,0 76.2,48.26 0,48.26 0,0
Copper layers (1*16): Top 0.0356mm / dielectric 1.5011mm / Bottom 0.0356mm
Design rules "oshpark-2layer-2017-05 *": minimum track width 6mil, minimum drill 13mil, track to track 6mil, track to pad 6mil, pad to pad 6mil, via to via 6mil, smd to smd 6mil, copper to edge 15mil, drill to drill 6mil, minimum pad ring 7mil, minimum via ring 7mil, stop-mask expansion 2.5mil, vias tented up to drill 25mil, thermal gap 10mil

### Footprints (pad centres in the part's own frame; a part is rotated, then mirrored left to right if it is on the bottom)
0603 = smd 1.1 x 1: 1 -0.85,0; 2 0.85,0
0805 = smd 1.3 x 1.5: 1 -0.95,0; 2 0.95,0
ML20 = drill 0.914 octagon: 1 -11.43,-1.27; 2 -11.43,1.27; 3 -8.89,-1.27; 4 -8.89,1.27; 5 -6.35,-1.27; 6 -6.35,1.27; 7 -3.81,-1.27; 8 -3.81,1.27; 9 -1.27,-1.27; 10 -1.27,1.27; 11 1.27,-1.27; 12 1.27,1.27; 13 3.81,-1.27; 14 3.81,1.27; 15 6.35,-1.27; 16 6.35,1.27; 17 8.89,-1.27; 18 8.89,1.27; 19 11.43,-1.27; 20 11.43,1.27
SOD-123 = smd 1.4 x 1.4: A 1.85,0; C -1.85,0
3,2 = hole 3.2: 0,0
TQFP100 = smd 1.754 x 0.3: 1 -6.73,4.73; 2 -6.73,4.23; 3 -6.73,3.73; 4 -6.73,3.23; 5 -6.73,2.73; 6 -6.73,2.23; 7 -6.73,1.73; 8 -6.73,1.23; 9 -6.73,0.73; 10 -6.73,0.23; 11 -6.73,-0.27; 12 -6.73,-0.77; 13 -6.73,-1.27; 14 -6.73,-1.77; 15 -6.73,-2.27; 16 -6.73,-2.77; 17 -6.73,-3.27; 18 -6.73,-3.77; 19 -6.73,-4.27; 20 -6.73,-4.77; 21 -6.73,-5.27; 22 -6.73,-5.77; 23 -6.73,-6.27; 24 -6.73,-6.77; 25 -6.73,-7.27; 51 9.27,-7.27; 52 9.27,-6.77; 53 9.27,-6.27; 54 9.27,-5.77; 55 9.27,-5.27; 56 9.27,-4.77; 57 9.27,-4.27; 58 9.27,-3.77; 59 9.27,-3.27; 60 9.27,-2.77; 62 9.27,-1.77; 63 9.27,-1.27; 64 9.27,-0.77; 65 9.27,-0.27; 66 9.27,0.23; 67 9.27,0.73; 68 9.27,1.23; 69 9.27,1.73; 70 9.27,2.23; 72 9.27,3.23; 73 9.27,3.73; 74 9.27,4.23; 75 9.27,4.73 | smd 0.3 x 1.754: 26 -4.73,-9.27; 27 -4.23,-9.27; 28 -3.73,-9.27; 29 -3.23,-9.27; 30 -2.73,-9.27; 31 -2.23,-9.27; 32 -1.73,-9.27; 33 -1.23,-9.27; 34 -0.73,-9.27; 35 -0.23,-9.27; 36 0.27,-9.27; 37 0.77,-9.27; 38 1.27,-9.27; 39 1.77,-9.27; 40 2.27,-9.27; 41 2.77,-9.27; 42 3.27,-9.27; 43 3.77,-9.27; 44 4.27,-9.27; 45 4.77,-9.27; 46 5.27,-9.27; 47 5.77,-9.27; 48 6.27,-9.27; 49 6.77,-9.27; 50 7.27,-9.27; 76 7.27,6.73; 77 6.77,6.73; 78 6.27,6.73; 79 5.77,6.73; 80 5.27,6.73; 81 4.77,6.73; 82 4.27,6.73; 83 3.77,6.73; 84 3.27,6.73; 85 2.77,6.73; 86 2.27,6.73; 87 1.77,6.73; 88 1.27,6.73; 89 0.77,6.73; 90 0.27,6.73; 91 -0.23,6.73; 92 -0.73,6.73; 93 -1.23,6.73; 94 -1.73,6.73; 95 -2.23,6.73; 96 -2.73,6.73; 97 -3.23,6.73; 98 -3.73,6.73; 99 -4.23,6.73; 100 -4.73,6.73 | smd 1.754 x 0.35: 61 9.27,-2.27; 71 9.27,2.73
8S2 = smd 0.5 x 1.4: 1 -1.905,-3.404; 2 -0.645,-3.404; 3 0.625,-3.404; 4 1.895,-3.404; 5 1.905,3.404; 6 0.635,3.404; 7 -0.635,3.404; 8 -1.905,3.404
SO8-GW300 = smd 1 x 1.27: 1 -4.69,3.937; 2 -4.69,1.27; 3 -4.69,-1.27; 4 -4.69,-3.937; 5 4.69,-3.937; 6 4.69,-1.27; 7 4.69,1.27; 8 4.69,3.937
2X02 = drill 1.016 octagon: 1 -1.27,-1.27; 2 -1.27,1.27; 3 1.27,-1.27; 4 1.27,1.27
CHIPLED_0805 = smd 1.2 x 1.2: A 0,-1.05; C 0,1.05
CP-2350 = drill 1.321 pad 2.184 octagon: 1 7.62,12.58; 3 -7.52,12.58; 4 5.08,15.02; 5 -5.08,15.02; PE -2.54,2.62; PE1 -5.08,2.62; PE2 5.08,2.62; PE@ 2.54,2.62 | drill 1.321 long: 2 0,12.68
OSC_7X5MM = smd 1.8 x 2: 1 -2.54,-2.1; 2 2.54,-2.1; 3 2.54,2.1; 4 -2.54,2.1
_0805 = smd 1.2 x 1.3: 1 -1.016,0; 2 1.016,0
TC2050-IDC-NL = smd 0.787 x 0.787: 1 -2.54,-0.635; 2 -2.54,0.635; 3 -1.27,-0.635; 4 -1.27,0.635; 5 0,-0.635; 6 0,0.635; 7 1.27,-0.635; 8 1.27,0.635; 9 2.54,-0.635; 10 2.54,0.635 | hole 0.991: -3.81,0; 3.81,1.016; 3.81,-1.016
1X01_ROUND = drill 1.245 pad 1.676: 1 0,0
SO8 = smd 0.65 x 1.75: 1 -1.905,-2.8; 2 -0.635,-2.8; 3 0.635,-2.8; 4 1.905,-2.8; 5 1.905,2.8; 6 0.635,2.8; 7 -0.635,2.8; 8 -1.905,2.8
SOT-143B = smd 1 x 0.6: 1 -0.75,-1.05 | smd 0.6 x 0.6: 2 0.95,-1.05; 3 0.95,1.05; 4 -0.95,1.05
SOT223-R = smd 1.3 x 1.3: 1 -2.3,-3.05; 2 0,-3.05; 3 2.3,-3.05 | smd 3.6 x 1.3: 4 0,3.05
TE-292304-1 = drill 0.95 octagon: 1 1.25,4.71; 2 -1.25,4.71; 3 -1.25,2.71; 4 1.25,2.71 | drill 2.3: P$1 6.02,0; P$2 -6.02,0
B4B-XH = drill 0.94 square: P$1 -3.81,0 | drill 0.94: P$2 -1.27,0; P$3 1.27,0; P$4 3.81,0
HC49UP = smd 5.334 x 1.93: 1 -4.826,0; 2 4.826,0

### Placement (x,y rotation side)
C1  29.84,12.7 270 top
C2  61.47,44.96 90 top
C3  21.97,10.67 270 top
C4  27.69,24.38 0 top
C5  10.92,8 90 top
C6  10.92,11.94 90 top
C7  39.12,30.35 180 top
C8  41.27,8.26 0 top
C9  53.72,4.45 180 top
C10  34.16,4.45 0 top
C11  55.37,23.62 180 top
C12  49.15,8.38 180 top
C13  53.85,13.08 270 top
C14  53.09,25.53 0 top
C15  35.69,27.94 0 top
C16  34.04,11.56 90 top
C17  45.59,8.51 180 top
C18  16.51,30.86 0 top
C19  36.83,39.12 270 top
C20  43.18,40.01 90 top
C21  18.54,40.51 90 top
C52  49.66,23.24 0 bottom
CTRL  71.12,24.13 270 top
D1  14.73,39.62 180 top
DAC  4.7,24.13 90 top
H1  2.54,45.72 0 top
H2  73.66,2.54 0 top
H3  2.54,2.54 0 top
H4  73.66,45.72 0 top
IC1  42.55,16.89 90 top
IC2  18.54,27.05 90 top
IC3  30.61,42.42 270 top
JP1  26.04,6.48 180 top
L1  39.88,38.23 180 top
L2  12.83,36.58 270 top
L3  22.86,36.7 90 top
L4  47.24,37.72 180 top
LED1  54.36,8.38 0 top
LED2  63.5,34.04 270 top
MIDI_IN  17.78,48.26 180 bottom
MIDI_OUT  43.18,48.26 180 bottom
OSC1  48.13,19.43 0 bottom
R1  53.21,31.75 180 top
R2  53.21,29.59 180 top
R3  59.05,44.96 90 top
R4  29.84,6.22 270 top
R5  21.97,6.22 90 top
R6  32.38,15.24 0 top
R7  52.2,8.38 90 top
R8  63.5,36.7 0 top
R9  23.62,41.4 180 top
R10  37.85,42.29 0 top
R11  40.77,34.04 90 top
R12  20.45,36.7 90 top
R13  45.59,33.91 90 top
R14  43.05,19.81 270 bottom
R48  44.7,23.88 0 bottom
TC1  29.63,29.97 270 top
TP18  41.66,28.57 0 top
TP_3.3V  61.85,7.37 0 top
TP_GND1  8.38,44.96 0 top
TP_GND2  65.15,7.37 0 top
U1  25.91,13.21 180 top
U2  58.42,35.18 270 top
U3  16.89,10.03 270 top
USB  60.96,44.07 180 bottom
X1  62.23,2.54 0 top
X2  13.97,2.54 0 top
Y1  43.94,4.57 0 top

### Tracks (layer width: path | path; a pad name or v marks a point on that pad's centre or on a via)
3.3V  (via drill 0.33, 0.6)
  Top 0.305: R13.1 44.39,32.96 v43.81,32.38 | IC1.21 47.81,11.24 47.88,11.3
  Bottom 0.305: v43.81,32.38 43.69,32.26 | OSC1.4 50.67,23.07 C52.1 50.51,24.04 v50.04,24.51
  pour Top: -4.06,51.82 81.41,51.82 81.41,-1.78 -3.94,-1.78
5.0V  (via drill 0.6)
  Top 0.305: C19.2 36.29,37.73 IC3.8 34.54,40.13 35.43,41.02 40.51,41.02 v42.55,43.05 | v48.64,43.05 53.09,47.5 67.44,47.5 69.22,45.72 69.22,42.42 70.61,41.02 72.9,41.02 74.55,39.37 v74.55,37.47 | v74.55,19.94 CTRL.16
  Top 1.27: U3.3 13.16,7.05 C5.1 10.16,6.29 X2.P$1 10.16,1.78 10.92,1.02 56.9,1.02 X1.P$1 58.42,7.49 v61.34,10.41 v62.23,11.3 v63.12,12.19 63.25,12.32
  Bottom 0.305: v42.55,43.05 v48.64,43.05 | v74.55,19.94 v74.55,37.47
  Bottom 1.27: 61.09,10.16 v61.34,10.41 v62.23,11.3 v63.12,12.19 68.71,17.78 CTRL.15 CTRL.16
CAN_H
  Top 0.406: U1.7 26.54,8.51 JP1.1
  Bottom 0.406: X1.P$3 62.36,3.68 60.2,3.68 59.69,3.17 59.69,1.78 59.18,1.27 15.88,1.27 15.24,1.91 X2.P$3 15.24,4.7 17.02,6.48 26.04,6.48 JP1.1
CAN_L
  Top 0.406: U1.6 25.27,8.26 JP1.3
  Bottom 0.406: X1.P$2 60.96,1.52 60.07,0.64 13.59,0.64 12.7,1.52 X2.P$2 12.7,3.17 16.64,7.11 24.13,7.11 JP1.3
CAN_RX
  Top 0.305: IC1.81 30.3,21.66 27.3,18.67 27.3,18.16 26.67,17.53 24.64,17.53 24,16.89 U1.4
CAN_TX
  Top 0.305: IC1.82 30.56,21.16 27.81,18.41 U1.1
DAC_CS  (via drill 0.33)
  Top 0.305: IC1.85 31.77,19.66 v31.75,19.68 | DAC.11 12.57,25.4 14.35,23.62 21.59,23.62 25.4,19.81 v26.16,19.81
  Bottom 0.305: v31.75,19.68 26.29,19.68 v26.16,19.81
FLASH_CS  (via drill 0.33, 0.6)
  Top 0.305: v23.62,28.96 IC2.4 | IC1.84 34.45,20.16 34.16,20.45 v30.99,20.45
  Bottom 0.305: v23.62,28.96 24.38,28.19 24.38,22.48 26.42,20.45 v30.99,20.45
GND  (via drill 0.33, 0.6)
  Top 0.305: C21.2 19.77,41.36 v19.81,41.4 | IC3.5 v26.67,39.75 | C19.1 38.19,39.97 v38.23,40.01 | R10.2 39.75,42.29 v40.26,42.8 | C20.2 44.66,40.85 v44.7,40.89 | TC1.3 TC1.5 28.61,29.97 27.85,29.21 v27.85,28.07 28.49,27.43 TC1.9 | C4.1 26.67,24.38 v25.4,25.65 | 36.66,27.81 C15.2 | C15.2 36.54,29.04 v36.58,29.08 | R3.2 C2.2 63.43,45.91 v63.5,45.97 | U2.1 56.65,35.93 v56.39,36.2 | C11.1 57.4,23.62 v57.78,24 | C14.2 v55.24,25.53 | C10.1 33.21,5.91 v33.27,5.97 | C9.1 54.67,5.78 v54.61,5.84 | v55.37,12.19 55.33,12.23 C13.2 53.42,12.66 IC1.27 | IC1.20 47.31,9.07 48.01,8.38 | C12.2 48.01,8.38 | 48.01,8.38 48.26,8.13 v48.26,6.99 | 44.74,7.96 C17.2 44.74,7.83 v45.21,7.37 | IC1.10 42.31,8.45 | IC1.99 34.29,12.66 C16.2 32.8,12.41 v32.77,12.45 | U1.8 28.4,10.41 C1.2 31.08,11.85 v31.11,11.81 | U1.2 v26.54,14.22 | C3.1 v21.97,13.08 | LED2.C 64.55,32.29 v64.14,31.88 | LED1.C 55.72,9.43 v55.75,9.4 | IC2.7 16.13,26.42 v16.51,26.8 | C18.2 17.36,29.63 v17.4,29.59 | v31.37,13.46 31.37,15.17 R6.1 | IC1.74 38.31,27.34 38.1,27.56 36.92,27.56 C15.2 | 42.31,8.45 C8.2 | 42.31,8.45 42.31,7.26 v42.29,7.24 | C7.1 40.07,29.27 v39.75,28.96
  Top 1.27: C5.2 9.21,8.95 9.02,9.14 v9.02,9.4 v9.02,10.29 v9.02,11.18 v9.02,12.06 v9.02,12.95 9.08,12.89 C6.2 10.98,12.83 11.94,12.83 12.43,12.33 U3.1
  Bottom 0.305: v19.81,41.4 19.94,41.4 | v26.67,39.75 26.67,40.13 | v38.23,40.01 38.48,40.01 | v40.26,42.8 40.39,42.93 | v44.7,40.89 44.83,40.89 44.96,40.77 | v27.85,28.07 27.85,28.45 | v25.4,25.65 25.4,26.04 | v36.58,29.08 36.58,29.21 | v63.5,45.97 63.75,45.97 | v56.39,36.2 56.13,36.45 | v57.78,24 57.91,24.13 | v55.24,25.53 55.37,25.53 | v33.27,5.97 33.27,6.22 | v55.37,12.19 55.5,12.19 55.63,12.32 | v45.21,7.37 45.34,7.37 | v32.77,12.45 32.51,12.45 | v31.11,11.81 31.24,11.81 | v26.54,14.22 26.54,13.97 | v21.97,13.08 21.97,13.34 | v64.14,31.88 64.01,31.75 | v16.51,26.8 16.76,26.8 | v17.4,29.59 17.4,29.34 | v42.29,7.24 42.16,7.11 | v39.75,28.96 39.62,28.83
  pour Bottom: -2.29,50.42 78.87,50.42 78.87,-3.43 -2.29,-3.43
I2S_BCK  (via drill 0.33, 0.6)
  Top 0.305: DAC.7 8.76,17.53 v20.07,17.53 | IC1.4 39.31,14.04 39.75,14.48 39.75,16.38 v39.37,16.76
  Bottom 0.305: v39.37,16.76 39.24,16.89 22.35,16.89 21.72,17.53 v20.07,17.53
I2S_CKIN  (via drill 0.33)
  Top 0.305: v42.42,24.38 42.31,24.49 IC1.66 42.31,27.92 TP18.1
  Bottom 0.305: R14.1 43.69,21.4 R48.2 42.93,23.88 v42.42,24.38
I2S_DATA  (via drill 0.33, 0.6)
  Top 0.305: 6.35,17.4 DAC.5 7.11,16.64 v21.21,16.64 | v38.48,16.13 38.48,15.62 38.31,15.46 IC1.2
  Bottom 0.305: v38.48,16.13 37.47,16.13 37.21,16.38 21.46,16.38 v21.21,16.64
I2S_DATA2  (via drill 0.33, 0.6)
  Top 0.305: v21.21,14.86 8.13,14.86 DAC.1 | v40.01,13.59 40.01,13.08 39.81,12.89 IC1.5
  Bottom 0.305: v21.21,14.86 22.1,14.86 22.35,15.11 36.7,15.11 37.72,14.1 39.5,14.1 v40.01,13.59
I2S_LRCK  (via drill 0.33, 0.6)
  Top 0.305: v20.07,15.75 6.48,15.75 DAC.3 | IC1.3 38.81,14.69 v38.99,14.86
  Bottom 0.305: v20.07,15.75 37.08,15.75 37.47,15.37 38.48,15.37 v38.99,14.86
I2S_MCK  (via drill 0.33, 0.6)
  Top 0.305: DAC.9 10.41,18.41 v20.83,18.41 | IC1.30 v44.39,14.16 | IC1.1 37.81,17.62 v37.85,17.65
  Bottom 0.305: v44.39,14.16 43.37,14.16 39.88,17.65 v37.85,17.65 35.05,17.65 34.8,17.4 22.61,17.4 21.59,18.41 v20.83,18.41
LCD_D0
  Top 0.305: IC1.38 59.56,18.16 68.2,26.8 71.25,26.8 CTRL.8
LCD_D1
  Top 0.305: IC1.39 59.3,18.66 68.58,27.94 CTRL.7
LCD_D2
  Top 0.305: IC1.40 58.91,19.16 68.96,29.21 71.12,29.21 CTRL.6
LCD_D3
  Top 0.305: IC1.41 58.52,19.66 69.34,30.48 CTRL.5
LCD_D4
  Top 0.305: IC1.42 58.26,20.16 68.58,30.48 68.58,31.24 69.09,31.75 71.12,31.75 CTRL.4
MIDI_IN
  Top 0.305: IC1.64 43.31,29.58 41.27,31.62 35.05,31.62 29.4,37.27 29.4,37.66 IC3.6 29.34,40.13 28.07,41.4 R9.1
MIDI_OUT
  Top 0.305: IC1.63 43.81,30.04 R11.1
N$1
  Top 0.305: IC1.94 33.41,15.16 R6.2
N$2
  Top 0.305: IC1.49 54.38,23.66 C11.2
N$3
  Top 0.305: IC1.73 38.81,29.7 C7.2
N$4
  Top 0.305: IC1.13 43.81,5.71 44.96,4.57 Y1.2 48.9,4.45 C9.2
N$5
  Top 0.305: IC1.12 43.31,5.98 41.91,4.57 Y1.1 35.24,4.57 C10.2
N$6
  Top 0.305: LED2.A 62.45,36.6 R8.1
N$7
  Top 0.406: JP1.2 29.78,5.21 R4.2
N$8
  Top 0.406: JP1.4 22.04,5.21 R5.1
N$9
  Top 0.406: R4.1 30.42,7.17 31.24,6.35 31.24,3.81 30.86,3.43 21.08,3.43 20.57,3.94 20.57,6.73 21.08,7.24 21.91,7.24 | 21.91,7.24 R5.2 | 21.91,7.24 21.91,9.65 C3.2 22.03,9.78 22.86,9.78 23.49,10.41 U1.5
N$10
  Top 0.305: IC1.25 51.37,10.16 R7.2
N$11  (via drill 0.33)
  Top 0.305: IC1.23 48.81,12.65 v48.64,12.83
  Bottom 0.305: R14.2 44.2,17.72 44.2,16.13 44.45,15.88 47.37,15.88 48.64,14.61 v48.64,12.83
N$12
  Top 0.305: LED1.A 52.3,7.33 R7.1
N$14
  Top 0.305: MIDI_OUT.5 38.1,37.4 L1.2
N$15
  Top 0.305: L1.1 40.83,35.05 R11.2
N$16
  Top 0.305: L3.1 MIDI_IN.4
N$17
  Top 0.305: R12.1 20.45,34.04 19.43,33.02 16.51,33.02 16.13,33.4 16.13,39.17 D1.C 16.64,39.68 16.64,41.53 18.41,43.31 28.07,43.31 31.87,47.11 IC3.2
N$18
  Top 0.305: R2.1 54.48,29.59 55.37,30.48 57.53,30.48 58.67,31.62 58.67,34.04 | 58.67,34.04 58.67,38.32 USB.2 | U2.3 58.87,34.23 58.67,34.04
N$19
  Top 0.305: R1.1 54.86,31.75 55.63,30.99 57.28,30.99 58.17,31.88 58.17,34.04 | USB.3 59.27,41.36 58.17,40.26 58.17,34.04 | U2.2 57.97,34.23 58.17,34.04
N$20
  Top 0.305: USB.P$1 61.53,44.07 C2.1 R3.1 55,44.01 USB.P$2
N$21
  Top 0.305: L2.1 12.83,39.57 D1.A 17.2,43.94 27.3,43.94 29.34,45.97 IC3.3
N$22
  Top 0.305: R10.1 32.89,42.29 31.88,41.27 IC3.7
N$23
  Top 0.305: C20.1 MIDI_OUT.2
N$24
  Top 0.305: C21.1 18.54,36.34 MIDI_IN.2
N$25
  Top 0.305: MIDI_IN.5 12.7,35.5 L2.2
N$26
  Top 0.305: R12.2 L3.2
N$27
  Top 0.305: R13.2 45.59,37.02 L4.2
N$28
  Top 0.305: MIDI_OUT.4 48.26,37.65 L4.1
N$32
  Bottom 0.305: R48.1 45.72,21.66 OSC1.3
NRST  (via drill 0.6)
  Top 0.305: IC1.14 44.31,11.31 43.31,12.32 43.31,20.45 v40.13,23.62 | C4.2 30.1,24.38 v30.35,24.13 31.76,25.54 31.76,26.76 31.09,27.43 TC1.10
  Bottom 0.305: v40.13,23.62 30.99,23.62 30.35,24.26 v30.35,24.13
ROT1_A
  Top 0.305: IC1.32 61.64,15.16 65.66,19.18 71.37,19.18 72.39,20.19 CTRL.14
ROT1_B
  Top 0.305: IC1.33 61.13,15.66 65.79,20.32 CTRL.13
ROT1_SW
  Top 0.305: IC1.34 60.74,16.16 66.29,21.72 71.25,21.72 CTRL.12
ROT2_A
  Top 0.305: IC1.36 60.09,17.16 67.18,24.26 71.25,24.26 CTRL.10
ROT2_B
  Top 0.305: IC1.37 59.83,17.66 67.56,25.4 CTRL.9
ROT2_SW
  Top 0.305: IC1.35 60.35,16.66 66.55,22.86 CTRL.11
SPI3_CLK
  Top 0.305: IC1.78 25.1,23.16 24.38,23.88 24.38,25.15 23.11,26.42 IC2.2 18.93,26.41 17.02,28.32 13.72,28.32 9.02,33.02 DAC.17
SPI3_MISO
  Top 0.305: IC1.79 24.84,22.66 23.88,23.62 23.88,24.89 22.99,25.78 16.76,25.78 16.13,25.15 IC2.8 14.35,25.15 13.08,26.42 8.51,26.42 7.24,27.69 7.24,29.21 DAC.15
SPI3_MOSI
  Top 0.305: IC1.80 24.57,22.16 23.37,23.37 23.37,24.51 22.73,25.15 IC2.1 18.41,25.15 17.65,24.38 14.35,24.38 12.83,25.91 8,25.91 DAC.13
SPI4_CLK
  Top 0.305: IC1.43 58,20.66 67.82,30.48 67.82,31.75 69.09,33.02 CTRL.3
SPI4_MISO
  Top 0.305: IC1.44 57.74,21.16 67.18,30.61 67.18,32.13 69.34,34.29 71.12,34.29 CTRL.2
SPI4_MOSI
  Top 0.305: IC1.45 57.48,21.66 66.55,30.73 66.55,32.26 CTRL.1
SWCLK
  Top 0.305: IC1.76 33.15,24.16 32.55,24.77 32.55,30.73 32.04,31.24 TC1.4
SWDIO
  Top 0.305: IC1.72 39.31,24.96 39.12,24.77 37.59,24.77 36.45,25.91 33.69,25.91 33.06,26.54 33.06,30.99 31.53,32.51 TC1.2
UART_RX  (via drill 0.33)
  Top 0.305: IC1.87 34.16,18.66 33.66,18.16 v31.62,18.16 | v31.66,28.7 TC1.8
  Bottom 0.305: v31.62,18.16 22.61,18.16 21.84,18.92 21.84,29.97 27.3,35.43 31.28,35.43 32.55,34.16 32.55,29.59 v31.66,28.7
UART_TX  (via drill 0.33)
  Top 0.305: IC1.86 33.89,19.16 33.66,18.92 v30.99,18.92 | TC1.6 v31.41,29.97
  Bottom 0.305: v30.99,18.92 23.11,18.92 22.35,19.68 22.35,29.72 27.56,34.92 31.03,34.92 32.04,33.91 32.04,30.48 31.53,29.97 v31.41,29.97
USB_DM
  Top 0.305: IC1.53 48.81,27.86 51.18,30.23 51.63,30.23 R2.2
USB_DP
  Top 0.305: IC1.54 48.31,28.12 51.18,30.99 51.5,30.99 R1.2
USB_VBUS
  Top 0.305: U2.4 60.26,36.13 60.33,36.07 | USB.1 60.33,37.47 60.33,36.07 | IC1.52 49.31,27.22 49.78,27.69 58.04,27.69 59.94,29.59 59.94,33.4 60.33,33.78 60.33,36.07

### Text on the board
tPlace: narvi-cpu rev 1.0 | Designed by Eran Rundstein | Pulsar Heavy Industries